# EAGLE design FlowControllerFinal (EAGLE 9.6.2)
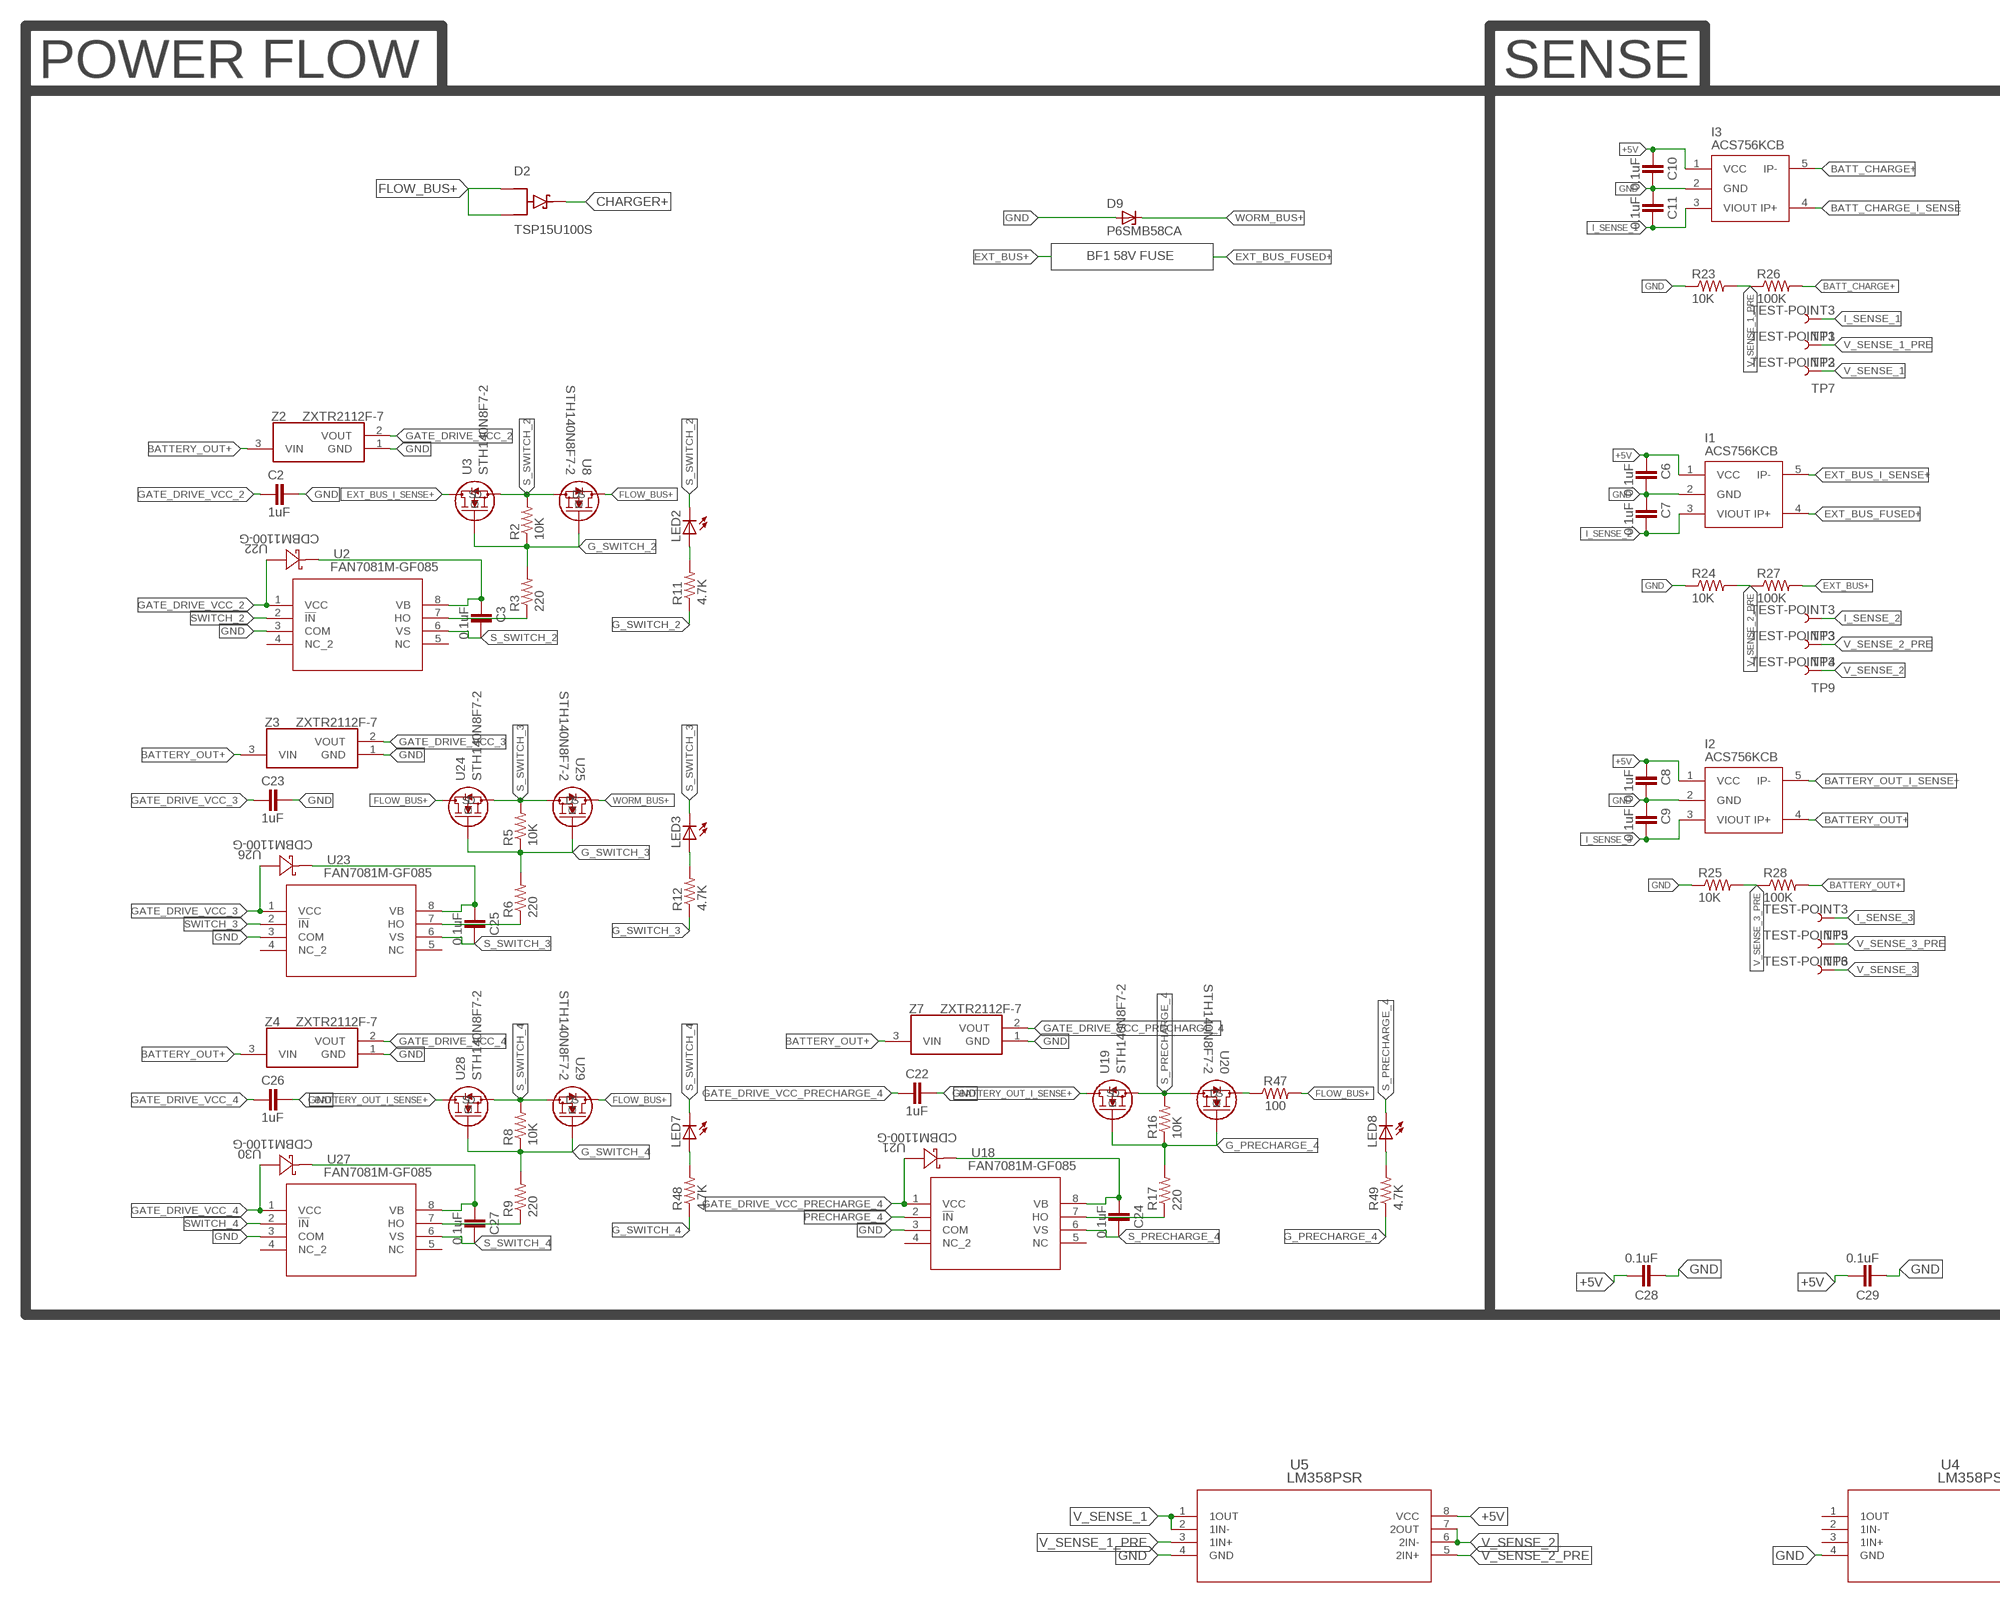
[diagram p0: schematic, sheet 1, part 1 of 2]
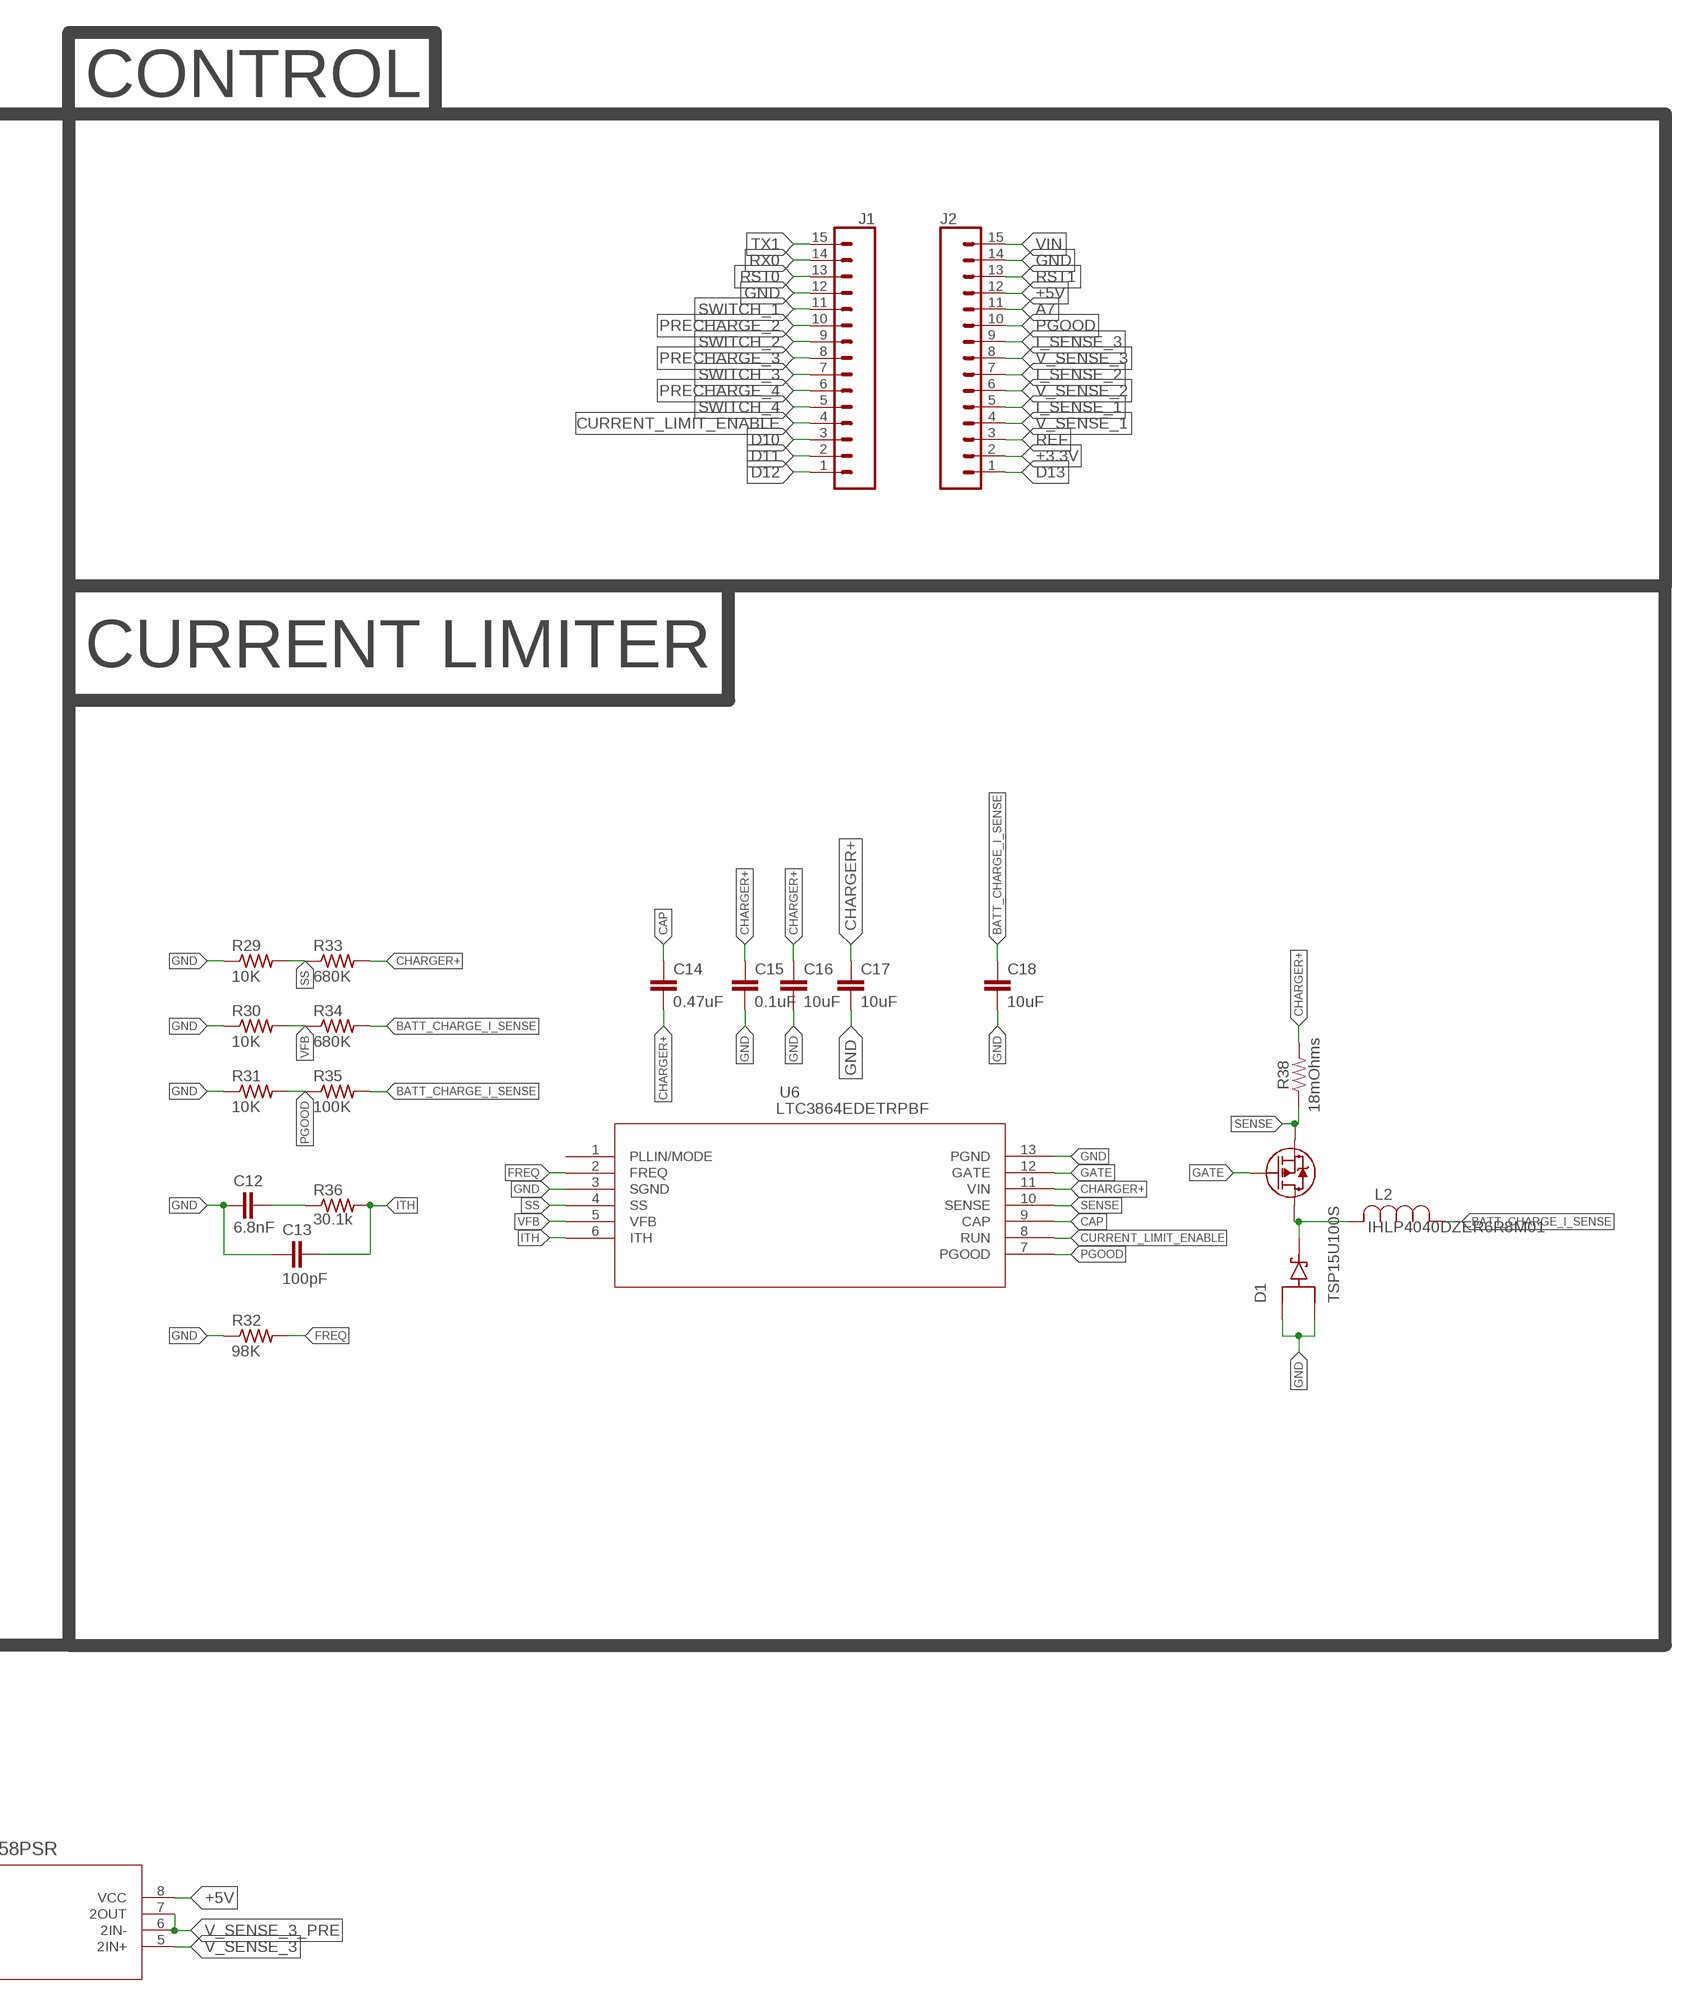
[diagram p1: schematic, sheet 1, part 2 of 2]

## Parts
C2  1uF  2.2UF-0805-25V-(+80/-20%)  [0805]
C3  0.1uF  2.2UF-0805-25V-(+80/-20%)  [0805]
C6  0.1uF  2.2UF-0805-25V-(+80/-20%)  [0805]
C7  0.1uF  2.2UF-0805-25V-(+80/-20%)  [0805]
C8  0.1uF  2.2UF-0805-25V-(+80/-20%)  [0805]
C9  0.1uF  2.2UF-0805-25V-(+80/-20%)  [0805]
C10  0.1uF  2.2UF-0805-25V-(+80/-20%)  [0805]
C11  0.1uF  2.2UF-0805-25V-(+80/-20%)  [0805]
C12  6.8nF  2.2UF-0805-25V-(+80/-20%)  [0805]
C13  100pF  2.2UF-0805-25V-(+80/-20%)  [0805]
C14  0.47uF  2.2UF-0805-25V-(+80/-20%)  [0805]
C15  0.1uF  2.2UF-0805-25V-(+80/-20%)  [0805]
C16  10uF  10UF-1210-50V-20%  [1210]
C17  10uF  10UF-1210-50V-20%  [1210]
C18  10uF  10UF-1210-50V-20%  [1210]
C22  1uF  2.2UF-0805-25V-(+80/-20%)  [0805]
C23  1uF  2.2UF-0805-25V-(+80/-20%)  [0805]
C24  0.1uF  2.2UF-0805-25V-(+80/-20%)  [0805]
C25  0.1uF  2.2UF-0805-25V-(+80/-20%)  [0805]
C26  1uF  2.2UF-0805-25V-(+80/-20%)  [0805]
C27  0.1uF  2.2UF-0805-25V-(+80/-20%)  [0805]
C28  0.1uF  2.2UF-0805-25V-(+80/-20%)  [0805]
C29  0.1uF  2.2UF-0805-25V-(+80/-20%)  [0805]
D1  TSP15U100S  [DIO_TSP15U100S]
D2  TSP15U100S  [DIO_TSP15U100S]
D9  P6SMB58CA  1SMB5913BT3G  [DO214AA]
I1  ACS756KCB  [ACS756KCB]
I2  ACS756KCB  [ACS756KCB]
I3  ACS756KCB  [ACS756KCB]
J1  CONN_15  [1X15]
J2  CONN_15  [1X15]
L2  IHLP4040DZER6R8M01  [IND_IHLP-4040DZ_VIS]
LED2  LEDCHIPLED_0805  [CHIPLED_0805]
LED3  LEDCHIPLED_0805  [CHIPLED_0805]
LED7  LEDCHIPLED_0805  [CHIPLED_0805]
LED8  LEDCHIPLED_0805  [CHIPLED_0805]
R2  10K  R-US_M0805  [M0805]
R3  220  R-US_M0805  [M0805]
R5  10K  R-US_M0805  [M0805]
R6  220  R-US_M0805  [M0805]
R8  10K  R-US_M0805  [M0805]
R9  220  R-US_M0805  [M0805]
R11  4.7K  R-US_M0805  [M0805]
R12  4.7K  R-US_M0805  [M0805]
R16  10K  R-US_M0805  [M0805]
R17  220  R-US_M0805  [M0805]
R23  10K  R-US_M0805  [M0805]
R24  10K  R-US_M0805  [M0805]
R25  10K  R-US_M0805  [M0805]
R26  100K  R-US_M0805  [M0805]
R27  100K  R-US_M0805  [M0805]
R28  100K  R-US_M0805  [M0805]
R29  10K  R-US_M0805  [M0805]
R30  10K  R-US_M0805  [M0805]
R31  10K  R-US_M0805  [M0805]
R32  98K  R-US_M0805  [M0805]
R33  680K  R-US_M0805  [M0805]
R34  680K  R-US_M0805  [M0805]
R35  100K  R-US_M0805  [M0805]
R36  30.1k  R-US_M0805  [M0805]
R37  RSJ250P10TL  [TRANS_R5009FNJ_ROM]
R38  18mOhms  0.05OHM-2512-3W-1%  [2512]
R47  100  0.05OHM-2512-3W-1%  [2512]
R48  4.7K  R-US_M0805  [M0805]
R49  4.7K  R-US_M0805  [M0805]
TP1  TEST-POINT3  [PAD.03X.03]
TP2  TEST-POINT3  [PAD.03X.03]
TP3  TEST-POINT3  [PAD.03X.03]
TP4  TEST-POINT3  [PAD.03X.03]
TP5  TEST-POINT3  [PAD.03X.03]
TP6  TEST-POINT3  [PAD.03X.03]
TP7  TEST-POINT3  [PAD.03X.03]
TP9  TEST-POINT3  [PAD.03X.03]
TP11  TEST-POINT3  [PAD.03X.03]
U2  FAN7081M-GF085  [SOIC8_3P9X4P9_ONS]
U3  STH140N8F7-2  [HPAK_0N8F7-2_STM]
U4  LM358PSR  [PS8]
U5  LM358PSR  [PS8]
U6  LTC3864EDETRPBF  [DFN-12_DE]
U8  STH140N8F7-2  [HPAK_0N8F7-2_STM]
U18  FAN7081M-GF085  [SOIC8_3P9X4P9_ONS]
U19  STH140N8F7-2  [HPAK_0N8F7-2_STM]
U20  STH140N8F7-2  [HPAK_0N8F7-2_STM]
U21  CDBM1100-G  [CDBM]
U22  CDBM1100-G  [CDBM]
U23  FAN7081M-GF085  [SOIC8_3P9X4P9_ONS]
U24  STH140N8F7-2  [HPAK_0N8F7-2_STM]
U25  STH140N8F7-2  [HPAK_0N8F7-2_STM]
U26  CDBM1100-G  [CDBM]
U27  FAN7081M-GF085  [SOIC8_3P9X4P9_ONS]
U28  STH140N8F7-2  [HPAK_0N8F7-2_STM]
U29  STH140N8F7-2  [HPAK_0N8F7-2_STM]
U30  CDBM1100-G  [CDBM]
Z2  ZXTR2112F-7  [SOT96P240X110-3N]
Z3  ZXTR2112F-7  [SOT96P240X110-3N]
Z4  ZXTR2112F-7  [SOT96P240X110-3N]
Z7  ZXTR2112F-7  [SOT96P240X110-3N]

## Nets
+3.3V: J2.2
+5V: C6.1 C8.1 C10.1 C28.2 C29.2 I1.1(VCC) I2.1(VCC) I3.1(VCC) J2.12 U4.8(VCC) U5.8(VCC)
A7: J2.11
BATT_CHARGE+: I3.5(IP-) R26.2
BATT_CHARGE_I_SENSE: C18.1 I3.4(IP+) L2.1 R34.2 R35.2
BATTERY_OUT+: I2.4(IP+) R28.2 Z2.3(VIN) Z3.3(VIN) Z4.3(VIN) Z7.3(VIN)
BATTERY_OUT_I_SENSE+: I2.5(IP-) U19.2(D) U28.2(D)
CAP: C14.1 U6.9(CAP)
CHARGER+: C14.2 C15.1 C16.1 C17.1 D2.3(K) R33.2 R38.P$2 U6.11(VIN)
CURRENT_LIMIT_ENABLE: J1.4 U6.8(RUN)
D10: J1.3
D11: J1.2
D12: J1.1
D13: J2.1
EXT_BUS+: R27.2
EXT_BUS_FUSED+: I1.4(IP+)
EXT_BUS_I_SENSE+: I1.5(IP-) U3.2(D)
FLOW_BUS+: D2.1(A1) D2.2(A2) R47.P$2 U8.2(D) U24.2(D) U29.2(D)
FREQ: R32.2 U6.2(FREQ)
G_PRECHARGE_4: R16.1 R17.2 R49.1 U19.1(G) U20.1(G)
G_SWITCH_2: R2.1 R3.2 R11.1 U3.1(G) U8.1(G)
G_SWITCH_3: R5.1 R6.2 R12.1 U24.1(G) U25.1(G)
G_SWITCH_4: R8.1 R9.2 R48.1 U28.1(G) U29.1(G)
GATE: R37.1 U6.12(GATE)
GATE_DRIVE_VCC_2: C2.1 U2.1(VCC) U22.2 Z2.2(VOUT)
GATE_DRIVE_VCC_3: C23.1 U23.1(VCC) U26.2 Z3.2(VOUT)
GATE_DRIVE_VCC_4: C26.1 U27.1(VCC) U30.2 Z4.2(VOUT)
GATE_DRIVE_VCC_PRECHARGE_4: C22.1 U18.1(VCC) U21.2 Z7.2(VOUT)
GND: C2.2 C6.2 C7.1 C8.2 C9.1 C10.2 C11.1 C12.1 C13.1 C15.2 C16.2 C17.2 C18.2 C22.2 C23.2 C26.2 C28.1 C29.1 D1.1(A1) D1.2(A2) D9.A I1.2(GND) I2.2(GND) I3.2(GND) J1.12 J2.14 R23.1 R24.1 R25.1 R29.1 R30.1 R31.1 R32.1 U2.3(COM) U4.4(GND) U5.4(GND) U6.3(SGND) U6.13(PGND) U18.3(COM) U23.3(COM) U27.3(COM) Z2.1(GND) Z3.1(GND) Z4.1(GND) Z7.1(GND)
I_SENSE_1: C11.2 I3.3(VIOUT) J2.5 TP1.P$1
I_SENSE_2: C7.2 I1.3(VIOUT) J2.7 TP3.P$1
I_SENSE_3: C9.2 I2.3(VIOUT) J2.9 TP5.P$1
ITH: C13.2 R36.2 U6.6(ITH)
N$2: LED8.A R49.2
N$3: LED2.A R11.2
N$7: R3.1 U2.7(HO)
N$9: C3.1 U2.8(VB) U22.1
N$13: R47.P$1 U20.2(D)
N$16: R6.1 U23.7(HO)
N$18: C25.1 U23.8(VB) U26.1
N$19: R17.1 U18.7(HO)
N$20: R9.1 U27.7(HO)
N$21: C24.1 U18.8(VB) U21.1
N$22: C27.1 U27.8(VB) U30.1
N$23: C12.2 R36.1
N$24: D1.3(K) L2.2 R37.2
N$26: LED3.A R12.2
N$27: LED7.A R48.2
PGOOD: J2.10 R31.2 R35.1 U6.7(PGOOD)
PRECHARGE_2: J1.10
PRECHARGE_3: J1.8
PRECHARGE_4: J1.6 U18.2(!IN)
REF: J2.3
RST0: J1.13
RST1: J2.13
RX0: J1.14
S_PRECHARGE_4: C24.2 LED8.C R16.2 U18.6(VS) U19.3(S) U20.3(S)
S_SWITCH_2: C3.2 LED2.C R2.2 U2.6(VS) U3.3(S) U8.3(S)
S_SWITCH_3: C25.2 LED3.C R5.2 U23.6(VS) U24.3(S) U25.3(S)
S_SWITCH_4: C27.2 LED7.C R8.2 U27.6(VS) U28.3(S) U29.3(S)
SENSE: R37.3 R38.P$1 U6.10(SENSE)
SS: R29.2 R33.1 U6.4(SS)
SWITCH_1: J1.11
SWITCH_2: J1.9 U2.2(!IN)
SWITCH_3: J1.7 U23.2(!IN)
SWITCH_4: J1.5 U27.2(!IN)
TX1: J1.15
V_SENSE_1: J2.4 TP7.P$1 U5.1(1OUT) U5.2(1IN-)
V_SENSE_1_PRE: R23.2 R26.1 TP2.P$1 U5.3(1IN+)
V_SENSE_2: J2.6 TP9.P$1 U5.6(2IN-) U5.7(2OUT)
V_SENSE_2_PRE: R24.2 R27.1 TP4.P$1 U5.5(2IN+)
V_SENSE_3: J2.8 TP11.P$1 U4.5(2IN+)
V_SENSE_3_PRE: R25.2 R28.1 TP6.P$1 U4.6(2IN-) U4.7(2OUT)
VFB: R30.2 R34.1 U6.5(VFB)
VIN: J2.15
WORM_BUS+: D9.C U25.2(D)
Unconnected: U2.4(NC_2) U2.5(NC) U4.1(1OUT) U4.2(1IN-) U4.3(1IN+) U6.1(PLLIN/MODE) U18.4(NC_2) U18.5(NC) U23.4(NC_2) U23.5(NC) U27.4(NC_2) U27.5(NC)

## Notes on the sheet
- POWER FLOW | SENSE | CONTROL
- BF1 58V FUSE
- CURRENT LIMITER

## Library data of the parts
C2 C3 C6-C15 C22-C29 = SparkFun-Capacitors:2.2UF: 2.2µF ceramic capacitors A capacitor is a passive two-terminal electrical component used to store electrical energy temporarily in an electric field.; PROD_ID: CAP-11624; VALUE: 2.2uF
C16-C18 = SparkFun-Capacitors:10UF: 10.0µF ceramic capacitors A capacitor is a passive two-terminal electrical component used to store electrical energy temporarily in an electric field.; PROD_ID: CAP-09824
D1 D2 = TSP15U100S:TSP15U100S; DESCRIPTION: 15A, 100V, Trench Schottky; DIGI-KEY_PART_NUMBER: 1801-TSP15U100STR-ND; MF: Taiwan Semiconductor; MP: TSP15U100S; PACKAGE: SMPC Taiwan Semiconductor; PURCHASE-URL: https://pricing.snapeda.com/search/part/TSP15U100S/?ref=eda
D9 = 1smb59xx_10:1SMB59*BT3G: 1SMB59xxBT3G Series 3 Watt Plastic Surface Mount Zener Voltage Regulators Source: http://www.onsemi.com/pub_link/Collateral/1SMB5913BT3-D.PDF; MF: ON Semiconductor; MPN: 1SMB5913BT3G; OC_FARNELL: 1431155; OC_NEWARK: 88H5165
I1-I3 = FlowControllerLib:ACS756KCB
J1 = SparkFun-Connectors:CONN_15: Multi connection point. Often used as Generic Header-pin footprint for 0.1 inch spaced/style header connections On any of the 0.1 inch spaced packages, you can populate with these: Break Away Headers - Straight <https://www.sparkfun.com/products/116> (PRT-00116) Break Away Male Headers - Right Angle <https://www.sparkfun.com/products/553> (PRT-00553) Female Headers <https://www.sparkfun.com/products/115> (PRT-00115) Break Away Headers - Machine Pin <https://www.sparkfun.com/products/117> (PRT-00117) Break Away Female Headers - Swiss Machine Pin <https://www.sparkfun.com/products/743> (PRT-00743) For SCREWTERMINALS and SPRING TERMINALS visit here: Screw Terimnals on SparkFun.com <https://www.sparkfun.com/search/results?term=Screw+Terminals> (5mm/3.5mm/2.54mm spacing) This device is also useful as a general connection point to wire up your design to another part of your project. Our various solder wires solder well into these plated through hole pads. Hook-Up Wire - Assortment (Stranded, 22 AWG) <https://www.sparkfun.com/products/11375> (PRT-11375) Hook-Up Wire - Assortment (Solid Core, 22 AWG) <https://www.sparkfun.com/products/11367> (PRT-11367) View the entire wire category on our website here <https://www.sparkfun.com/categories/141> Special notes: Molex polarized connector foot print use with SKU : PRT-08231 with associated crimp pins and housings. 1MM SMD Version SKU: PRT-10208 NOTES ON THE VARIANTS LOCK and LOCK_LONGPADS... This footprint was designed to help hold the alignment of a through-hole component (i.e. 6-pin header) while soldering it into place. You may notice that each hole has been shifted either up or down by 0.005 of an inch from it's more standard position (which is a perfectly straight line). This slight alteration caused the pins (the squares in the middle) to touch the edges of the holes. Because they are alternating, it causes a "brace" to hold the component in place. 0.005 has proven to be the perfect amount of "off-center" position when using our standard breakaway headers. Although looks a little odd when you look at the bare footprint, once you have a header in there, the alteration is very hard to notice. Also,if you push a header all the way into place, it is covered up entirely on the bottom side.
J2 = SparkFun-Connectors:CONN_15: Multi connection point. Often used as Generic Header-pin footprint for 0.1 inch spaced/style header connections On any of the 0.1 inch spaced packages, you can populate with these: Break Away Headers - Straight <https://www.sparkfun.com/products/116> (PRT-00116) Break Away Male Headers - Right Angle <https://www.sparkfun.com/products/553> (PRT-00553) Female Headers <https://www.sparkfun.com/products/115> (PRT-00115) Break Away Headers - Machine Pin <https://www.sparkfun.com/products/117> (PRT-00117) Break Away Female Headers - Swiss Machine Pin <https://www.sparkfun.com/products/743> (PRT-00743) For SCREWTERMINALS and SPRING TERMINALS visit here: Screw Terimnals on SparkFun.com <https://www.sparkfun.com/search/results?term=Screw+Terminals> (5mm/3.5mm/2.54mm spacing) This device is also useful as a general connection point to wire up your design to another part of your project. Our various solder wires solder well into these plated through hole pads. Hook-Up Wire - Assortment (Stranded, 22 AWG) <https://www.sparkfun.com/products/11375> (PRT-11375) Hook-Up Wire - Assortment (Solid Core, 22 AWG) <https://www.sparkfun.com/products/11367> (PRT-11367) View the entire wire category on our website here <https://www.sparkfun.com/categories/141> Special notes: Molex polarized connector foot print use with SKU : PRT-08231 with associated crimp pins and housings. 1MM SMD Version SKU: PRT-10208 NOTES ON THE VARIANTS LOCK and LOCK_LONGPADS... This footprint was designed to help hold the alignment of a through-hole component (i.e. 6-pin header) while soldering it into place. You may notice that each hole has been shifted either up or down by 0.005 of an inch from it's more standard position (which is a perfectly straight line). This slight alteration caused the pins (the squares in the middle) to touch the edges of the holes. Because they are alternating, it causes a "brace" to hold the component in place. 0.005 has proven to be the perfect amount of "off-center" position when using our standard breakaway headers. Although looks a little odd when you look at the bare footprint, once you have a header in there, the alteration is very hard to notice. Also,if you push a header all the way into place, it is covered up entirely on the bottom side.; SPICEPREFIX: X
L2 = CurrentLimiter:IHLP4040DZER6R8M01; COPYRIGHT: Copyright (C) 2022 Ultra Librarian. All rights reserved.; DIGI-KEY_PART_NUMBER_1: 541-1303-1-ND; DIGI-KEY_PART_NUMBER_2: 541-1303-2-ND; DIGI-KEY_PART_NUMBER_3: 541-1303-6-ND; MANUFACTURER_PART_NUMBER: IHLP4040DZER6R8M01; MFR_NAME: Vishay
LED2 LED3 LED7 LED8 = adafruit:LED: LED OSRAM: - CHIPLED LG R971, LG N971, LY N971, LG Q971, LY Q971, LO R971, LY R971 LH N974, LH R974 LS Q976, LO Q976, LY Q976 LO Q996 - Hyper CHIPLED LW Q18S LB Q993, LB Q99A, LB R99A - SideLED LS A670, LO A670, LY A670, LG A670, LP A670 LB A673, LV A673, LT A673, LW A673 LH A674 LY A675 LS A676, LA A676, LO A676, LY A676, LW A676 LS A679, LY A679, LG A679 - Hyper Micro SIDELED® LS Y876, LA Y876, LO Y876, LY Y876 LT Y87S - SmartLED LW L88C, LW L88S LB L89C, LB L89S, LG L890 LS L89K, LO L89K, LY L89K LS L896, LA L896, LO L896, LY L896 - TOPLED LS T670, LO T670, LY T670, LG T670, LP T670 LSG T670, LSP T670, LSY T670, LOP T670, LYG T670 LG T671, LOG T671, LSG T671 LB T673, LV T673, LT T673, LW T673 LH T674 LS T676, LA T676, LO T676, LY T676, LB T676, LH T676, LSB T676, LW T676 LB T67C, LV T67C, LT T67C, LS T67K, LO T67K, LY T67K, LW E67C LS E67B, LA E67B, LO E67B, LY E67B, LB E67C, LV E67C, LT E67C LW T67C LS T679, LY T679, LG T679 LS T770, LO T770, LY T770, LG T770, LP T770 LB T773, LV T773, LT T773, LW T773 LH T774 LS E675, LA E675, LY E675, LS T675 LS T776, LA T776, LO T776, LY T776, LB T776 LHGB T686 LT T68C, LB T68C - Hyper Mini TOPLED® LB M676 - Mini TOPLED Santana® LG M470 LS M47K, LO M47K, LY M47K Source: http://www.osram.convergy.de/
R2 R3 R5 R6 R8 R9 R11 R12 R16 R17 R23-R36 R48 R49 = adafruit:R-US_: RESISTOR, American symbol
R37 = CurrentLimiter:RSJ250P10TL; COPYRIGHT: Copyright (C) 2022 Ultra Librarian. All rights reserved.; DIGI-KEY_PART_NUMBER_1: RSJ250P10TLCT-ND; DIGI-KEY_PART_NUMBER_2: RSJ250P10TLDKR-ND; DIGI-KEY_PART_NUMBER_3: RSJ250P10TLTR-ND; MANUFACTURER_PART_NUMBER: RSJ250P10TL; MFR_NAME: ROHM Semiconductor
R38 R47 = SparkFun-Resistors:0.05OHM: 0.05Ω resistor A resistor is a passive two-terminal electrical component that implements electrical resistance as a circuit element. Resistors act to reduce current flow, and, at the same time, act to lower voltage levels within circuits. - Wikipedia; PROD_ID: RES-13771; VALUE: 0.05
TP1-TP7 TP9 TP11 = SparkFun-Connectors:TEST-POINT: SparkFun Test Points Bare copper test points for troubleshooting or In-Circuit-Testing. These are used by our Production team for verifying production board runs using pogo-pins on test beds. SparkFun Products: SparkFun LSM9DS1 Breakout <https://www.sparkfun.com/products/13284> SparkFun PSOC <https://www.sparkfun.com/products/13714> SparkFun Load Cell Amplifier <https://www.sparkfun.com/products/13879>
U2 U18 U23 U27 = FlowControllerLib:FAN7081M-GF085; COPYRIGHT: Copyright (C) 2022 Ultra Librarian. All rights reserved.; DIGI-KEY_PART_NUMBER_1: FAN7081M-GF085-ND; MANUFACTURER_PART_NUMBER: FAN7081M-GF085; MFR_NAME: onsemi
U3 U8 U19 U20 U24 U25 U28 U29 = FlowControllerLib:STH140N8F7-2; COPYRIGHT: Copyright (C) 2022 Ultra Librarian. All rights reserved.; DIGI-KEY_PART_NUMBER_1: 497-14534-2-ND; DIGI-KEY_PART_NUMBER_2: 497-14534-1-ND; DIGI-KEY_PART_NUMBER_3: 497-14534-6-ND; MANUFACTURER_PART_NUMBER: STH140N8F7-2; MFR_NAME: STMicroelectronics
U4 U5 = FlowControllerLib:LM358PSR; COPYRIGHT: Copyright (C) 2022 Ultra Librarian. All rights reserved.; DIGI-KEY_PART_NUMBER_1: 296-1396-1-ND; DIGI-KEY_PART_NUMBER_2: 296-1396-2-ND; DIGI-KEY_PART_NUMBER_3: 296-1396-6-ND; DIGI-KEY_PART_NUMBER_4: 2156-LM358PSR-ND; MANUFACTURER_PART_NUMBER: LM358PSR; MFR_NAME: Texas Instruments
U6 = LTC3864EDETRPBF:LTC3864EDETRPBF; DESCRIPTION: Buck Regulator Positive Output Step-Down - DC-DC Controller IC 12-DFN (4x3); DIGI-KEY_PART_NUMBER: 161-LTC3864EDE#TRPBFTR-ND; MF: Analog Devices; MP: LTC3864EDE#TRPBF; PACKAGE: DFN -12 Analog Devices; PURCHASE-URL: https://pricing.snapeda.com/search/part/LTC3864EDE#TRPBF/?ref=eda
U21 U22 U26 U30 = FlowControllerLib:CDBM1100-G; COPYRIGHT: Copyright (C) 2022 Ultra Librarian. All rights reserved.; DIGI-KEY_PART_NUMBER_1: 641-1331-1-ND; DIGI-KEY_PART_NUMBER_2: 641-1331-2-ND; DIGI-KEY_PART_NUMBER_3: 641-1331-2-NDL; DIGI-KEY_PART_NUMBER_4: 641-1331-6-ND; MANUFACTURER_PART_NUMBER: CDBM1100-G; MFR_NAME: Comchip
Z2-Z4 Z7 = SamacSys_Parts:ZXTR2112F-7: Linear Voltage Regulators Transistor Array Zener Linear Reg Source: Datasheet <https://www.diodes.com/assets/Datasheets/ZXTR2112F.pdf>; DESCRIPTION: Linear Voltage Regulators Transistor Array Zener Linear Reg; HEIGHT: 1.1mm; MANUFACTURER_NAME: Diodes Inc.; MANUFACTURER_PART_NUMBER: ZXTR2112F-7; MOUSER_PART_NUMBER: 621-ZXTR2112F-7; MOUSER_PRICE-STOCK: https://www.mouser.co.uk/ProductDetail/Diodes-Incorporated/ZXTR2112F-7?qs=AsTZqt%2FmeqkIS3oif4D14w%3D%3D

## Board
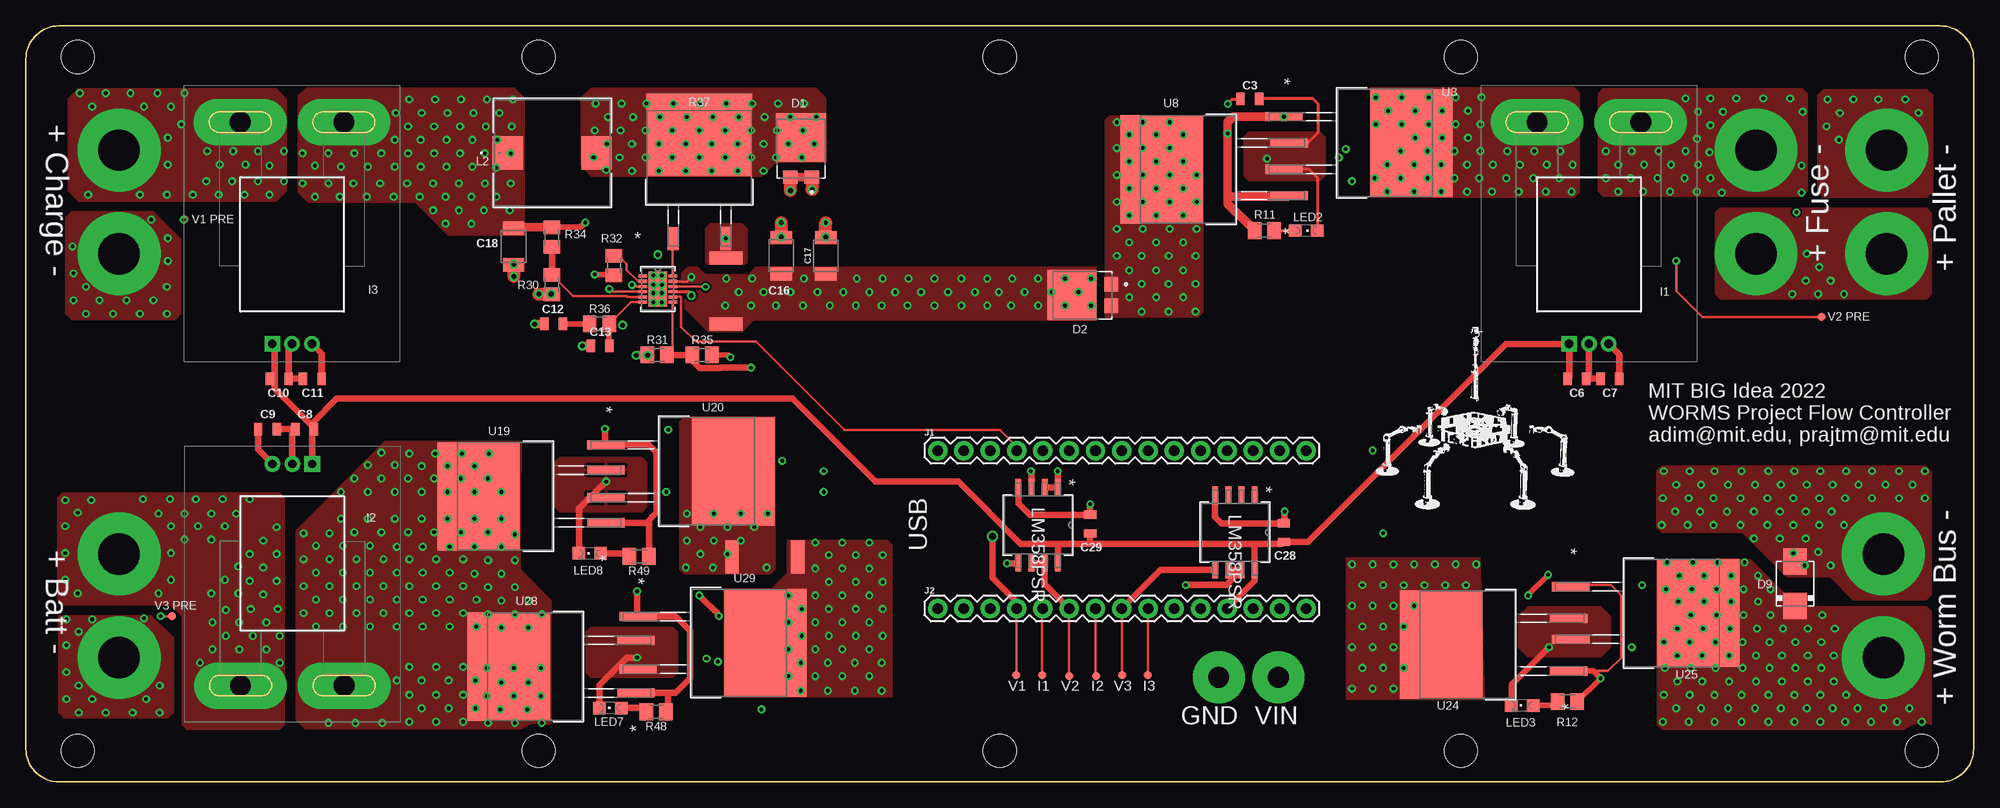
[diagram p2: board, top side]
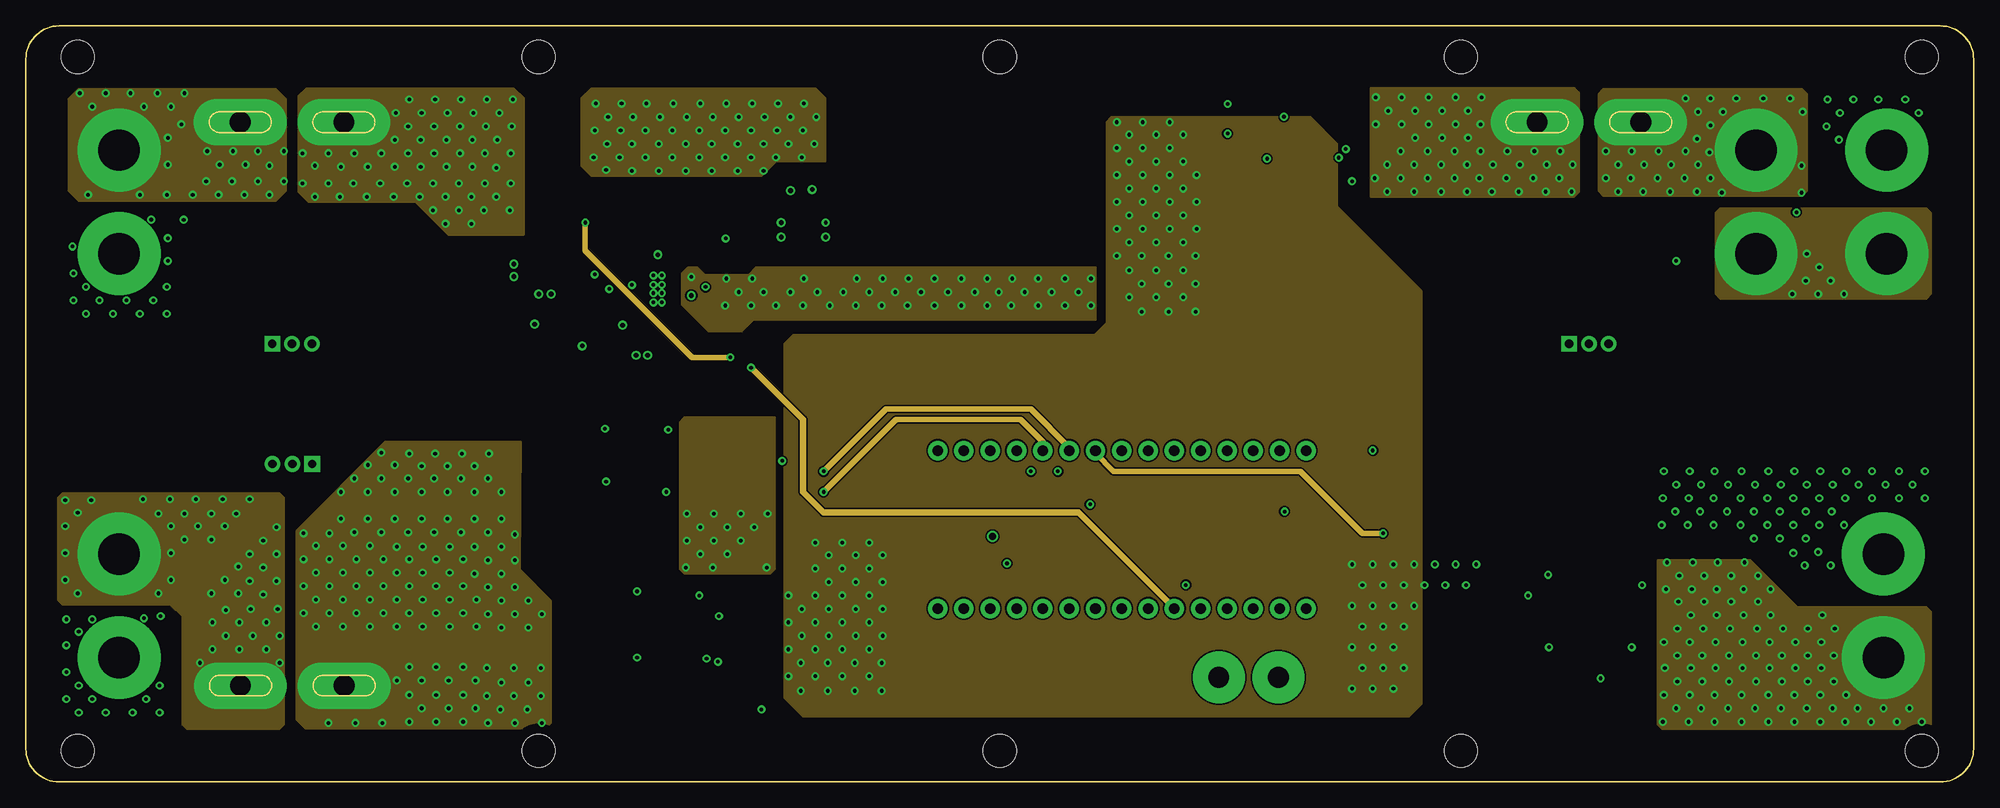
[diagram p3: board, inner layer Route2]
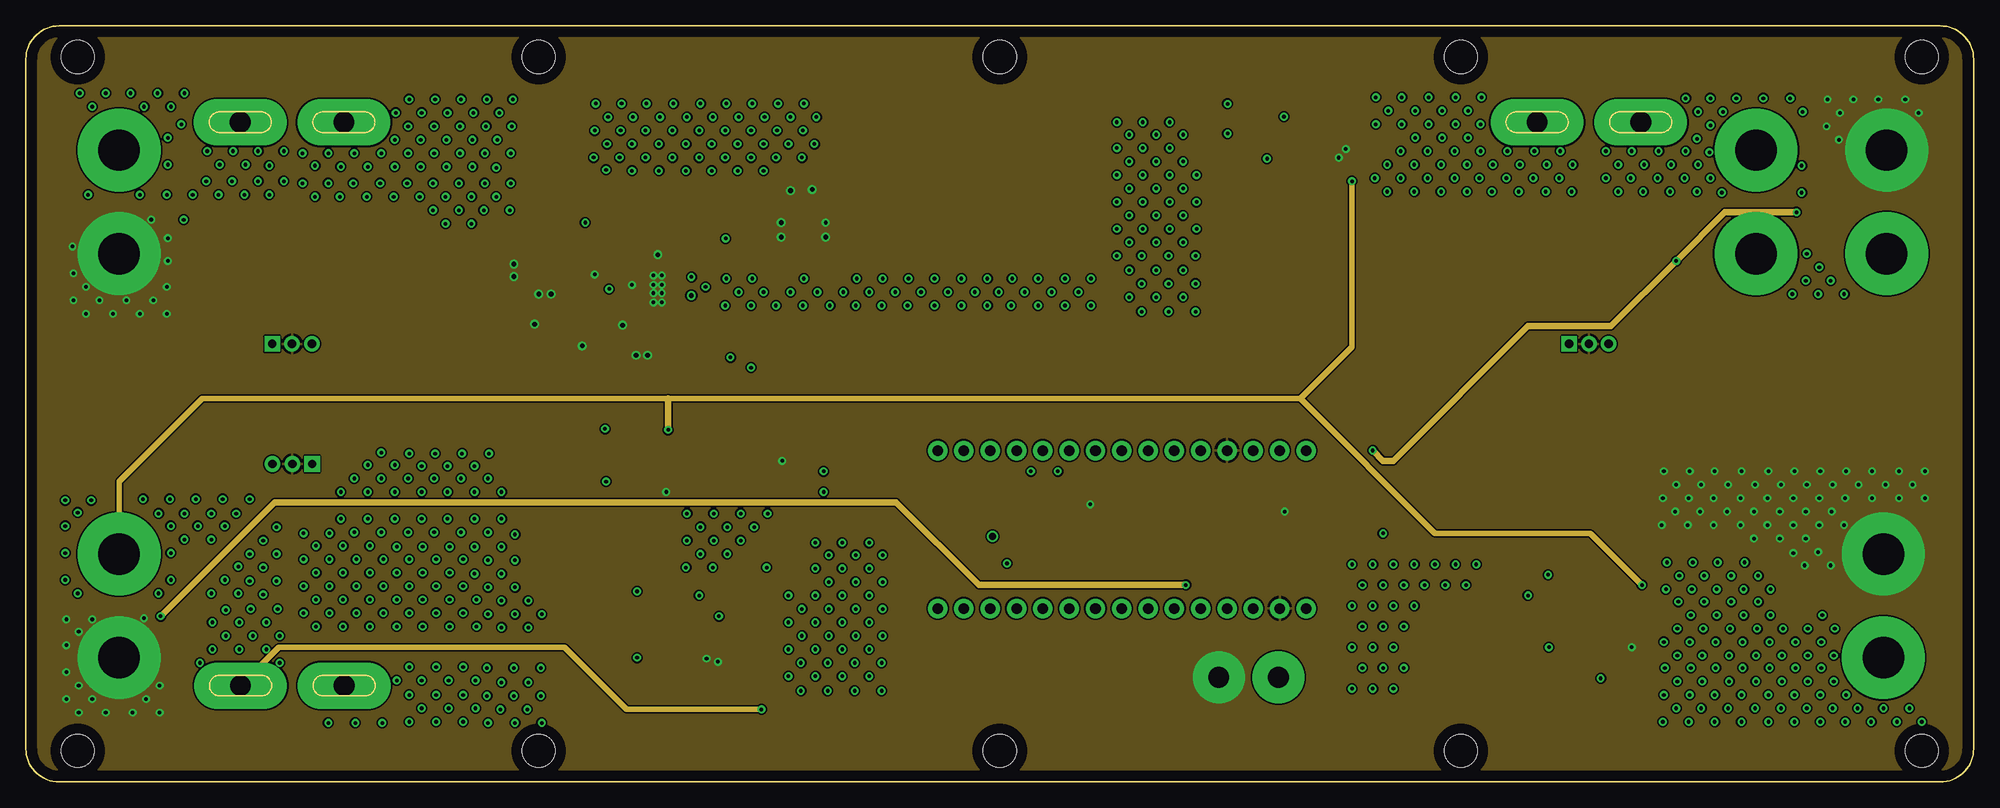
[diagram p4: board, inner layer Route15]
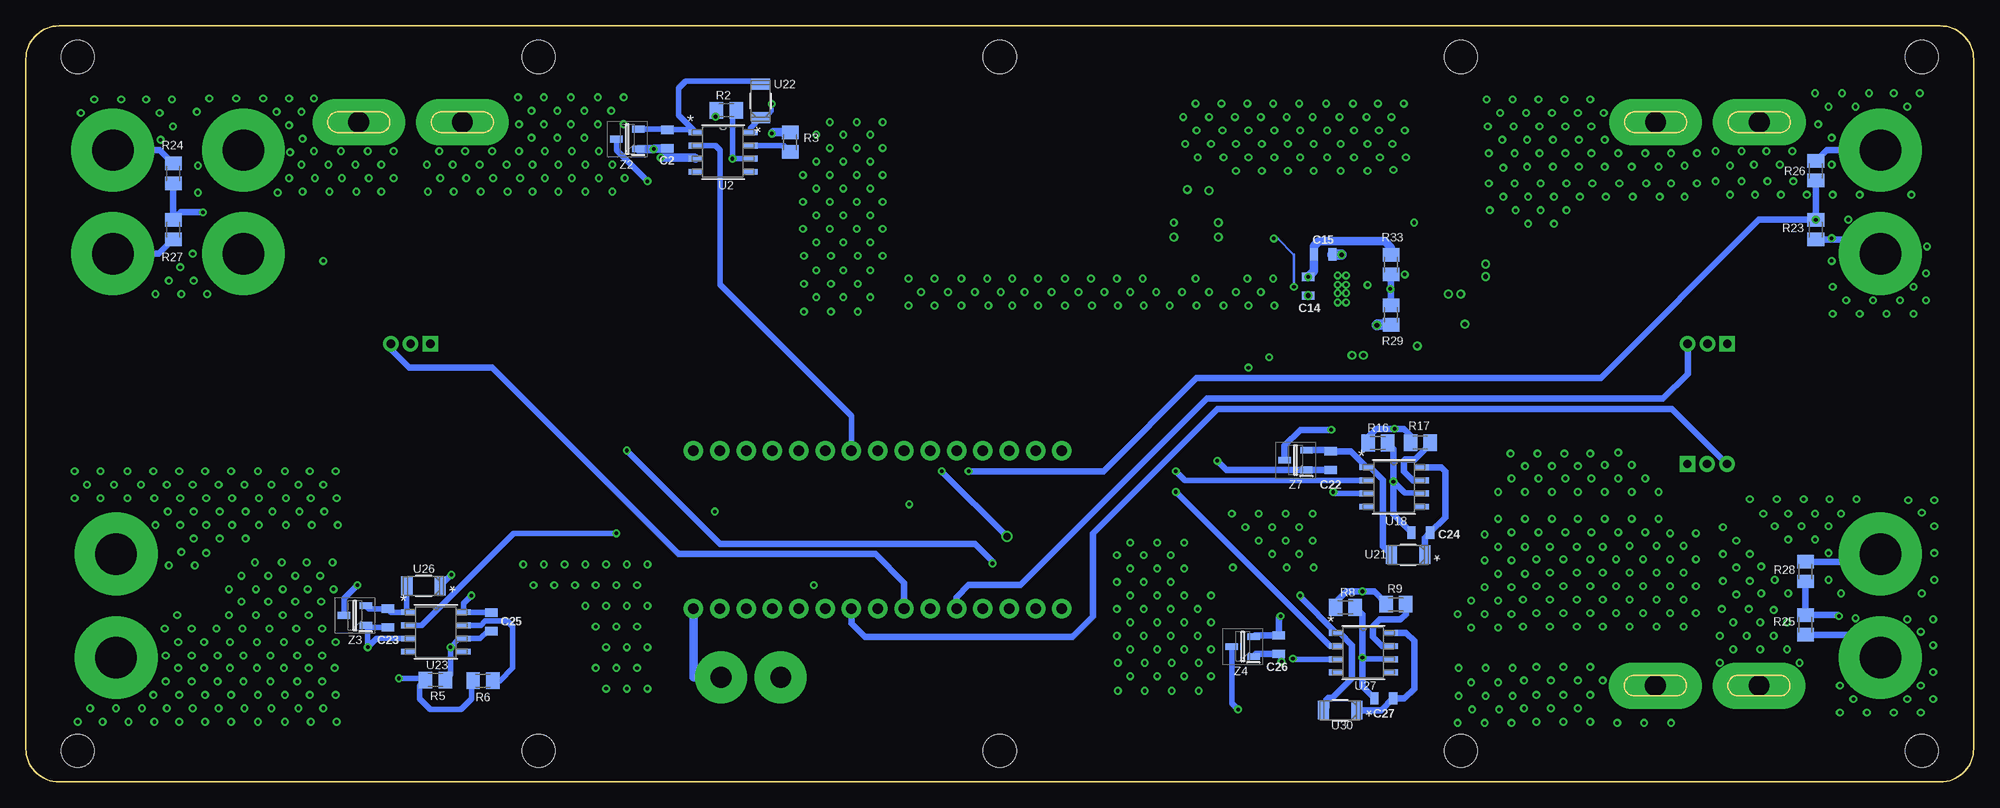
[diagram p5: board, bottom side, seen from below]

Size 188 x 73 mm. Coordinates in mm from the lower left corner, seen from the top.
Outline: 188,3.2 188,69.8 arc90 184.8,73 3.2,73 arc90 0,69.8 0,3.2 arc90 3.2,0 184.8,0 arc90 188,3.2
Copper layers (1+2*15+16): Top 0.035mm / dielectric 1.5mm / Route2 0.035mm / dielectric 0.15mm / Route15 0.035mm / dielectric 0.2mm / Bottom 0.035mm
Design rules "default *": minimum track width 6mil, minimum drill 0.35mm, track to track 6mil, track to pad 6mil, pad to pad 6mil, via to via 6mil, smd to smd 6mil, copper to edge 40mil, drill to drill 6mil, minimum pad ring 10mil, minimum via ring 8mil, stop-mask expansion 4mil, vias tented up to drill 0.45mm, thermal gap 10mil
Holes 3.2 mm at 5,3 49.5,3 94,3 138.5,3 183,3 5,70 49.5,70 94,70 138.5,70 183,70

### Footprints (pad centres in the part's own frame; a part is rotated, then mirrored left to right if it is on the bottom)
0805 = smd 0.8 x 1.2: 1 -0.9,0; 2 0.9,0
1210 = smd 1.27 x 2.06: 1 -1.755,0; 2 1.755,0
DIO_TSP15U100S = smd 1.27 x 1.4: 1 -2.765,-1.04; 2 -2.765,1.04 | smd 4.72 x 4.8: 3 1.04,0
DO214AA = smd 2.5 x 2.3: A 2.15,0; C -2.15,0
ACS756KCB = drill 0.8 pad 1.5 square: 1 -1.91,-10.7 | drill 0.8 pad 1.5: 2 0,-10.7; 3 1.91,-10.7 | drill 2 pad 4.5 long: 4 5,10.7; 5 -5,10.7
1X15 = drill 1.016 pad 1.88: 1 0,0; 2 2.54,0; 3 5.08,0; 4 7.62,0; 5 10.16,0; 6 12.7,0; 7 15.24,0; 8 17.78,0; 9 20.32,0; 10 22.86,0; 11 25.4,0; 12 27.94,0; 13 30.48,0; 14 33.02,0; 15 35.56,0
IND_IHLP-4040DZ_VIS = smd 2.921 x 3.251: 1 -4.28,0; 2 4.28,0
CHIPLED_0805 = smd 1.2 x 1.2: A 0,-1.05; C 0,1.05
M0805 = smd 1.3 x 1.6: 1 -0.95,0; 2 0.95,0
TRANS_R5009FNJ_ROM = smd 1.041 x 2.199: 1 -2.54,-7.861; 3 2.54,-7.861 | smd 10.16 x 7.95: 2 0,2.146
2512 = smd 1.27 x 3.175: P$1 -3.175,0; P$2 3.175,0
PAD.03X.03 = smd 0.762 x 0.762: P$1 0,0
SOIC8_3P9X4P9_ONS = smd 1.411 x 0.558: 1 -2.642,1.905; 2 -2.642,0.635; 3 -2.642,-0.635; 4 -2.642,-1.905; 5 2.642,-1.905; 6 2.642,-0.635; 7 2.642,0.635; 8 2.642,1.905
HPAK_0N8F7-2_STM = smd 0.888 x 3.596: 1 -2.54,-9.779; 3 2.54,-9.779 | smd 10.439 x 7.95: 2 0,2.527
PS8 = smd 1.64 x 0.558: 1 -3.632,1.905; 2 -3.632,0.635; 3 -3.632,-0.635; 4 -3.632,-1.905; 5 3.632,-1.905; 6 3.632,-0.635; 7 3.632,0.635; 8 3.632,1.905
DFN-12_DE = smd 0.813 x 0.305: 1 -1.448,1.25; 2 -1.448,0.75; 3 -1.448,0.25; 4 -1.448,-0.25; 5 -1.448,-0.75; 6 -1.448,-1.25; 7 1.448,-1.25; 8 1.448,-0.75; 9 1.448,-0.25; 10 1.448,0.25; 11 1.448,0.75; 12 1.448,1.25 | smd 1.803 x 3.404: 13 0,0
CDBM = smd 1.092 x 1.803: 1 -1.613,0; 2 1.613,0
SOT96P240X110-3N = smd 1.2 x 0.65: 1 -1.05,0.96; 2 -1.05,-0.96; 3 1.05,0

### Placement (x,y rotation side)
C2  126.07,62.06 270 bottom
C3  118.13,65.93 0 top
C6  149.7,38.93 0 top
C7  152.89,38.93 0 top
C8  26.92,34.07 180 top
C9  23.33,34.07 180 top
C10  24.46,38.93 0 top
C11  27.65,38.93 0 top
C12  50.94,44.23 0 top
C13  55.43,42.13 0 top
C14  64.23,47.86 90 bottom
C15  62.78,50.93 0 bottom
C16  72.92,50.81 90 top
C17  77.2,50.8 90 top
C18  47.08,51.69 270 top
C22  62.07,31.02 270 bottom
C23  153.07,15.83 270 bottom
C24  53.36,24.07 180 bottom
C25  143.07,15.45 270 bottom
C26  67.07,13.26 270 bottom
C27  56.93,8.07 180 bottom
C28  121.43,24.08 270 top
C29  102.73,24.89 270 top
D1  74.82,61.15 90 top
D2  102,47 180 top
D9  170.77,19.14 90 top
I1  150.87,53 0 top
I2  25.72,20 180 top
I3  25.69,53 0 top
J1  88,32 0 top
J2  88,16.75 0 top
L2  50.81,60.75 0 top
LED2  123.58,53.23 270 top
LED3  144.42,7.39 90 top
LED7  56.42,7.15 90 top
LED8  54.42,22.07 90 top
R2  120.4,64.85 0 bottom
R3  114.23,61.77 90 bottom
R5  148.48,9.85 0 bottom
R6  143.88,9.77 180 bottom
R8  60.64,16.85 0 bottom
R9  55.76,17.15 180 bottom
R11  119.56,53.23 0 top
R12  148.79,7.77 180 top
R16  57.51,32.73 0 bottom
R17  53.41,32.77 180 bottom
R23  15.23,53.33 90 bottom
R24  173.77,58.75 270 bottom
R25  16.23,15.17 90 bottom
R26  15.23,59.01 90 bottom
R27  173.77,53.34 270 bottom
R28  16.23,20.31 90 bottom
R29  56.23,45.09 90 bottom
R30  50.77,48.01 90 top
R31  60.93,41.23 0 top
R32  56.77,49.85 90 top
R33  56.23,49.96 90 bottom
R34  50.77,52.61 90 top
R35  65.26,41.23 0 top
R36  55.36,44.23 0 top
R37  65.01,60.33 0 top
R38  67.6,47.4 270 top
R47  71.33,21.74 0 top
R48  60.84,6.77 180 top
R49  59.19,21.77 180 top
TP1  98.1,10.3 0 top
TP2  15.3,54.3 0 top
TP3  103.3,10.2 0 top
TP4  173.3,44.9 0 top
TP5  108.3,10.3 0 top
TP6  14.1,16 0 top
TP7  95.6,10.3 0 top
TP9  100.7,10.2 0 top
TP11  105.8,10.3 0 top
U2  120.71,60.81 0 bottom
U3  131.21,61.69 270 top
U4  116.7,24.1 270 top
U5  97.7,24.8 270 top
U6  60.99,47.58 0 top
U8  112.16,59.15 90 top
U18  55.94,28.48 0 bottom
U19  46.23,27.57 90 top
U20  65.77,29.99 270 top
U21  54.58,21.93 180 bottom
U22  117.07,65.75 90 bottom
U23  148.42,14.48 0 bottom
U24  139.13,13.25 90 top
U25  158.87,16.31 270 top
U26  149.62,18.93 180 bottom
U27  58.9,12.48 0 bottom
U28  49.13,11.13 90 top
U29  68.87,13.43 270 top
U30  61.14,6.93 180 bottom
Z2  129.95,62.07 180 bottom
Z3  156.25,16.07 180 bottom
Z4  70.55,13.07 180 bottom
Z7  65.45,31.07 180 bottom

### Tracks (layer width: path | path; a pad name or v marks a point on that pad's centre or on a via)
+5V
  Top 0.61: I3.1 24,42.08 24,39 | 24,39 24,38 27.63,34.37 | 27.63,34.37 27.63,34 | 27.63,34 I2.1 | 27.63,34.37 27.63,34.63 30,37 74,37 82,29 90,29 96,23 99.7,23 | 99.7,23 102.73,23 | C10.1 23.63,39 24,39 | C8.1 27.75,34 27.63,34 | C6.1 148.96,39.09 I1.1 142.85,42.3 123.73,23.18 C28.2 121.25,23 118.6,23 | C29.2 102.73,23 | U5.8 99.61,22.91 99.7,23 | U4.8 | U4.8 118.6,23 | 102.73,23 118.6,23 | J2.12 118.6,19.41 U4.8
BATT_CHARGE+  (via drill 0.35, 4 pad 8)
  Bottom 0.61: v9,61 14.19,61 R26.2
  other vias: 15,63.5 13.7,62.2 17.5,60.9 20,60.9 22.4,60.9 24.9,60.9 13.7,59.6 18.7,59.6 21.2,59.6 6,56.7 11,56.7 13.6,56.7 17.4,58 16.1,56.7 19.9,58 18.6,56.7 21.1,56.7 23.5,56.7 22.4,58 24.9,58 23.5,59.5 5.2,66.5 6.4,65.2 10.1,66.5 12.7,66.5 15.3,66.5 7.7,66.5 11.4,65.2 14,65.2
  pour Top (no thermals): 4.08,65.92 4.08,57.08 5.08,56.08 24.12,56.08 25.12,57.08 25.12,65.92 24.12,66.92 5.08,66.92
  pour Route2 (no thermals): 4.08,65.92 4.08,57.08 5.08,56.08 24.12,56.08 25.12,57.08 25.12,65.92 24.12,66.92 5.08,66.92
BATT_CHARGE_I_SENSE  (via drill 0.35)
  Top 0.508: R35.2 67.77,41.23 v68,41 | R34.2 53.56,53.56 v54,54
  Top 0.813: 46.59,53.56 R34.2
  Route2 0.508: v54,54 54,51.3 64.3,41 v68,41
  other vias: 26.7,60.7 36.9,63.3 31.7,60.7 34.3,60.7 35.6,62 36.9,60.7 29.2,60.7 39.4,63.3 38.1,62 39.4,60.7 42,65.9 40.7,64.6 43.2,64.6 41.9,60.7 41.9,63.3 40.6,62 44.3,60.7 43.1,62 37,65.9 35.7,64.6 39.5,65.9 38.2,64.6 45.5,62 46.8,60.7 44.4,63.3 47,65.9 45.7,64.6 46.9,63.3 44.5,65.9 27.9,59.5 30.4,59.4 33,59.4 35.6,59.4 38.1,59.4 40.6,59.4 43.1,59.4 26.7,57.8 27.9,56.5 31.6,57.8 34.2,57.8 36.8,57.8 29.2,57.8 30.3,56.5 32.9,56.5 35.5,56.5 39.3,57.8 38,56.5 39.3,55.2 41.8,55.2 41.8,57.8 40.5,56.5 44.2,55.2 43,56.5 45.4,56.5 46.7,55.2 44.3,57.8 46.8,57.8 40.5,53.9 43,53.9 45.4,59.3
  pour Top (no thermals): 26.3,66.2 26.3,57 27.3,56 37.6,56 40.8,52.8 48.1,52.8 48.1,66 47.1,67 27.1,67
  pour Route2 (no thermals): 26.3,66.2 26.3,57 27.3,56 37.6,56 40.8,52.8 48.1,52.8 48.1,66 47.1,67 27.1,67
BATTERY_OUT+  (via drill 0.35, 4 pad 8)
  Route15 0.508: v128,58 128,42 123,37 | 123,37 62,37 17,37 9,29 v9,22 | 123,37 136,24 151,24 v156,19 | I2.4 24.42,13 52,13 58,7 v71,7
  Route15 0.61: v62,34 62,37
  Bottom 0.508: v128,58 131,61 Z2.3 | v156,19 157.3,17.7 Z3.3 | Z4.3 71.6,7.6 v71,7
  Bottom 0.61: R28.2 9.74,21.26 v9,22 | Z7.3 66.5,32.5 65,34 v62,34
  other vias: 5,18.2 5,26 6.3,27.2 3.8,22.1 3.8,19.5 3.8,24.7 3.8,27.2 14,19.5 17.9,18.2 20.5,20.8 19.2,19.5 20.5,18.2 14,24.7 15.3,23.4 14,22.1 16.6,24.7 17.9,23.4 19.2,24.7 15.3,25.9 17.9,25.9 12.8,18.2 12.8,25.9 11.3,27.3 13.9,27.3 16.4,27.3 19,27.3 21.6,27.3 21.6,22 21.6,19.4 22.9,18.1 24.2,22 22.9,20.7 24.2,19.4 20.3,25.9 24.2,24.6 22.9,23.3 24.5,11.5 18,15.4 19.3,14.1 18,12.8 20.6,15.4 21.9,14.1 20.6,12.8 23.2,15.4 23.2,12.8 19.3,16.6 16.8,11.5 24.5,14.1 21.7,16.7 24.3,16.7
  pour Top (no thermals): 15.06,16.04 15.08,16.02 15.08,5.58 15.58,5.08 24.42,5.08 24.92,5.58 24.92,27.42 24.42,27.92 3.58,27.92 3.08,27.42 3.08,17.58 3.58,17.08 14.02,17.08 14.04,17.06
  pour Route2 (no thermals): 15.06,16.04 15.08,16.02 15.08,5.58 15.58,5.08 24.42,5.08 24.92,5.58 24.92,27.42 24.42,27.92 3.58,27.92 3.08,27.42 3.08,17.58 3.58,17.08 14.02,17.08 14.04,17.06
BATTERY_OUT_I_SENSE+  (via drill 0.35)
  other vias: 28,15 29.3,18.9 28,17.6 29.3,16.3 30.6,15 31.9,18.9 30.6,17.6 31.9,16.3 33.2,15 34.5,18.9 33.2,17.6 34.5,16.3 28,22.8 29.3,21.5 28,20.2 30.6,22.8 31.9,21.5 30.6,20.2 33.2,22.8 33.2,20.2 29.3,24 29.2,5.7 31.8,5.7 34.4,5.7 26.8,18.9 26.8,16.3 26.8,21.5 26.8,24 38.3,17.6 37,11.1 38.2,9.8 37,8.4 37,16.3 38.3,15 40.9,17.6 39.6,11.1 40.8,9.8 39.6,8.4 39.6,16.3 40.9,15 43.5,17.6 42.2,11.1 43.4,9.8 42.2,8.4 42.2,16.3 43.5,15 37,21.5 38.3,20.2 37,18.9 39.6,21.5 40.9,20.2 39.6,18.9 42.2,21.5 42.2,18.9 38.3,22.7 40.9,22.7 37,5.8 38.2,7.1 39.6,5.8 40.8,7.1 42.2,5.8 43.4,7.1 35.8,9.8 35.8,17.6 35.8,15 35.8,20.2 35.8,22.7 34.5,21.5 30.4,25.4 31.7,24.1 33,25.4 34.3,24.1 35.6,25.4 36.9,24.1 31.7,29.3 30.4,28 33,30.6 34.3,29.3 33,28 35.6,30.6 35.6,28 34.3,31.8 40.7,25.4 39.4,24.1 43.3,25.4 42,24.1 45.9,25.4 44.6,24.1 39.4,29.3 40.7,28 42,29.3 43.3,28 44.6,29.3 40.7,30.5 43.3,30.5 38.2,25.4 38.2,28 38.2,30.5 36.9,29.3 44.6,18.8 44.5,11 44.6,16.2 45.9,14.9 47.2,18.8 47.1,11 45.9,9.6 45.9,17.5 47.2,16.2 48.5,14.9 49.7,11 48.5,9.6 48.5,17.5 49.8,16.2 43.3,22.7 44.6,21.4 43.3,20.1 45.9,22.7 47.2,21.4 45.9,20.1 47.2,23.9 44.5,8.3 47.1,8.3 49.7,8.3 49.8,5.7 48.4,7 47.2,5.7 45.8,7 44.6,5.7 45.9,28 39.5,31.7 42.1,31.7 44.7,31.7 37,31.7
  pour Top (no thermals): 27,5.11 38.02,5.11 50.1,5.1 50.7,5.7 50.7,17.5 47.69,20.51 47.79,32.85 34.68,32.85 26.08,24.25 26.08,6.03
  pour Route2 (no thermals): 27,5.11 38.02,5.11 50.1,5.1 50.7,5.7 50.7,17.5 47.69,20.51 47.79,32.85 34.68,32.85 26.08,24.25 26.08,6.03
CAP  (via drill 0.45)
  Top 0.305: U6.9 64.04,47.33 64.23,47.14 C14.1
  other vias: 64.23,46.96
CHARGER+  (via drill 0.35)
  Top 0.254: 63.7,48.33 U6.11 63.8,48.33 C14.2 | D2.3 101.3,47 v101.6,47.3
  Top 0.813: 72.97,49.01 C16.1
  Bottom 0.813: R33.2 56.23,51.61 56.82,52.2 63.2,52.2 63.68,51.72 C15.1 63.68,49.31 C14.2
  other vias: 67.5,46 72.4,46 75,46 77.6,46 70,46 80.1,46 82.7,48.6 81.4,47.3 85.2,48.6 83.9,47.3 82.6,46 86.4,47.3 87.7,48.6 87.7,46 89,47.3 90.3,48.6 90.3,46 91.6,47.3 85.1,46 92.8,48.6 92.8,46 67.6,48.6 68.8,47.3 75.1,48.6 70.1,48.6 71.2,47.3 73.8,47.3 76.4,47.3 80.2,48.6 78.9,47.3 95.2,48.6 93.9,47.3 96.4,47.3 97.7,48.6 97.7,46 99,47.3 100.3,48.6 100.3,46 95.1,46 102.8,48.6 102.8,46 64.23,48.76
  pour Top (no thermals): 103.3,49.7 70.5,49.7 69.8,49 65.5,49 64.8,49.7 63.9,49.7 63.3,49.1 63.3,46.1 65.9,43.5 69.1,43.5 70.2,44.6 103.3,44.6
  pour Route2 (no thermals): 103.3,49.7 70.5,49.7 69.8,49 65.5,49 64.8,49.7 63.9,49.7 63.3,49.1 63.3,46.1 65.9,43.5 69.1,43.5 70.2,44.6 103.3,44.6
CURRENT_LIMIT_ENABLE
  Top 0.254: U6.8 62.47,46.86 63.14,46.86 63.26,46.74 63.26,43.94 64.7,42.5 70.5,42.5 79,34 94,34 95.62,32.38 J1.4
EXT_BUS+  (via drill 0.35, 4 pad 8)
  Bottom 0.61: R27.2 175.16,51 v179.6,51
  other vias: 167,51 170.5,47.1 171.8,48.4 173,47.1 174.2,48.4 175.5,47.1 171.9,51 173.1,49.7
  pour Route2 (no thermals): 163.08,54.92 163.08,47.13 163.58,46.63 183.42,46.63 183.92,47.13 183.92,54.92 183.42,55.42 163.58,55.42
  pour Top (no thermals): 163.08,54.92 163.08,47.13 163.58,46.63 183.42,46.63 183.92,47.13 183.92,54.92 183.42,55.42 163.58,55.42
EXT_BUS_FUSED+  (via drill 0.35, 4 pad 8)
  other vias: 167,61 152.5,60.9 152.5,58.3 155,60.9 157.6,60.9 160.2,60.9 156.2,59.6 154.9,58.3 156.1,57 158.8,59.6 157.5,58.3 158.7,57 161.4,59.6 160.1,58.3 161.3,57 153.7,59.6 153.7,57 162.6,58.3 163.7,56.9 171.4,59.5 171.4,56.9 170.3,66 167.7,66 165.1,66 163.8,64.7 171.5,64.7 161.3,62.1 161.4,64.7 160.2,66 162.6,63.4 162.6,66 162.5,60.8
  pour Route2 (no thermals): 151.78,66.42 151.78,57.08 152.28,56.58 171.42,56.58 171.92,57.08 171.92,66.42 171.42,66.92 152.28,66.92
  pour Top (no thermals): 151.78,66.42 151.78,57.08 152.28,56.58 171.42,56.58 171.92,57.08 171.92,66.42 171.42,66.92 152.28,66.92
EXT_BUS_I_SENSE+  (via drill 0.35)
  other vias: 132.8,63.5 132.7,60.9 132.8,66.1 131.5,64.8 135.4,63.5 134.1,62.2 135.3,60.9 135.4,66.1 134.1,64.8 138,63.5 136.7,62.2 137.9,60.9 138,66.1 136.7,64.8 130.3,63.5 130.3,66.1 131.4,59.6 131.4,57 132.7,58.3 134,59.6 134,57 135.3,58.3 136.6,59.6 136.6,57 137.9,58.3 130.2,58.3 140.4,60.9 143,60.9 145.6,60.9 141.6,59.6 140.3,58.3 141.5,57 144.2,59.6 142.9,58.3 144.1,57 146.8,59.6 145.5,58.3 146.7,57 139.1,59.6 139.1,57 140.5,66.1 140.4,63.5 139.2,64.8 139.2,62.2 148.1,60.9 149.3,59.6 148,58.3 149.2,57
  pour Route2 (no thermals): 129.78,67.02 129.78,56.48 149.42,56.48 149.92,56.98 149.92,66.52 149.42,67.02
  pour Top (no thermals): 129.78,56.48 149.42,56.48 149.92,56.98 149.92,66.52 149.42,67.02 129.78,67.02
FLOW_BUS+  (via drill 0.35)
  other vias: 74.9,14.1 73.6,10.2 74.8,8.8 73.6,12.8 74.8,11.5 73.6,18 74.9,16.7 73.6,15.4 140,21 139,19 133,19 128,21 130,21 132,21 131,19 132,17 131,15 130,17 129,15 128,17 129,19 136,21 135,19 137,19 138,21 134,17 134,21 133,15 128,13 130,13 132,13 131,11 132,9 130,9 129,11 133,11 128,9 77.5,14.1 76.2,10.2 77.4,8.8 76.2,12.8 77.4,11.5 76.2,18 77.5,16.7 76.2,15.4 80.1,14.1 78.8,10.2 80,8.8 78.8,12.8 80,11.5 78.8,18 80.1,16.7 78.8,15.4 82.7,14.1 81.4,10.2 82.6,8.8 81.4,12.8 82.6,11.5 81.4,18 82.7,16.7 81.4,15.4 77.5,21.9 76.2,20.6 77.5,19.3 80.1,21.9 78.8,20.6 80.1,19.3 82.7,21.9 81.4,20.6 82.7,19.3 76.2,23.1 78.8,23.1 81.4,23.1 106.5,54.7 107.8,58.6 106.5,52.1 107.7,50.8 106.5,49.4 106.5,57.3 107.8,53.4 107.8,56 109.1,54.7 110.4,58.6 109.1,52.1 110.3,50.8 109.1,49.4 109.1,57.3 110.4,53.4 110.4,56 111.7,54.7 113,58.6 111.7,52.1 112.9,50.8 111.7,49.4 111.7,57.3 113,53.4 113,56 106.5,62.5 107.8,61.2 106.5,59.9 109.1,62.5 110.4,61.2 109.1,59.9 111.7,62.5 111.7,59.9 107.8,63.7 110.4,63.7 106.5,46.8 107.7,45.4 107.7,48.1 109.1,46.8 110.3,45.4 110.3,48.1 111.7,46.8 112.9,45.4 112.9,48.1 105.3,50.8 105.3,53.4 105.3,58.6 105.3,56 105.3,61.2 105.3,63.7
  pour Top (no thermals): 67.4,8.2 83.62,8.2 83.62,22.82 83.12,23.32 73.53,23.32 73.53,20.13 72.03,18.63 67.4,18.62
  pour Top (no thermals): 127.47,7.97 140.76,7.97 140.37,21.63 127.47,21.63
  pour Route2 (rank 2, no thermals): 134.73,47.42 126.61,55.53 126.61,61.59 123.98,64.22 104.8,64.22 104.3,63.72 104.3,44.3 103.2,43.2 74.1,43.2 73.17,42.27 73.17,8.13 75.03,6.27 133.47,6.27 134.73,7.53
  pour Top (no thermals): 113.6,64.3 104.6,64.3 104.2,63.9 104.2,44.9 113.1,44.9 113.6,45.4
FREQ
  Top 0.254: U6.2 59.47,48.4 59.02,48.4 58,49.42 58,50 57.2,50.8 R32.2
G_PRECHARGE_4  (via drill 0.35)
  Top 0.254: 58.3,25 56.04,25 U19.1
  Top 0.61: v55.9,34.1 55.9,32.53 U20.1 56.06,32.6 60.1,32.6 60.9,31.8 60.9,26 59.9,25 58.3,25 | U19.1 60.14,25.03 R49.1
  Bottom 0.61: R17.2 54.36,33.46 55,34.1 v55.9,34.1 57.66,34.1 58.46,33.3 R16.1
G_SWITCH_2  (via drill 0.35)
  Top 0.61: 116,55.84 116,56.5
  Top 0.813: U8.1 121.83,56.5 116,56.5 | R11.1 116,55.84 v116,62.6 116,63.7 116.53,64.23 U3.1
  Bottom 0.813: R3.2 115.88,62.72 v116,62.6 | R2.1 121.43,64.77 U3.1
  other vias: 121.43,64.23
G_SWITCH_3  (via drill 0.35)
  Top 0.254: U25.1 149.24,19 153,19 154,18 154,12 152.71,10.71 U24.1
  Top 0.508: U24.1 151.29,10.71 v152,10 149.77,7.77 R12.1
  Bottom 0.508: v152,10 149.58,10 R5.1 150,9.28 150,8 149,7 146,7 145,8 145,9.6 R6.2
G_SWITCH_4  (via drill 0.35)
  Top 0.61: v59,18.4 59,16.06 U29.1 62.73,15.97 64.1,14.6 64.1,10 62.69,8.59 61.91,8.59 | U28.1 61.91,8.59 | 61.91,8.59 62,8.5 62,6.98 R48.1
  Bottom 0.61: R8.1 61.59,17.35 60.54,18.4 v59,18.4 57.86,18.4 56.71,17.25 R9.2
GATE
  Top 0.254: U6.12 62.44,52.44 R37.1
GATE_DRIVE_VCC_2
  Bottom 0.508: U22.2 117.36,67.65 124.35,67.65 125,67 125,64.36 U2.1 123.6,62.96 C2.1 126.14,63.03 Z2.2
GATE_DRIVE_VCC_3
  Bottom 0.508: U26.2 151.23,16.56 U23.1 152.72,16.39 C23.1 154.9,16.73 Z3.2
GATE_DRIVE_VCC_4  (via drill 0.35)
  Top 0.61: v65,18 66.89,16.11 v66.89,16
  Bottom 0.61: U30.2 62.47,7.21 62.47,7.92 62.3,8.1 61.9,8.1 60,10 60,13.21 61.18,14.38 U27.1 65,17.84 v65,18 | Z4.2 69.37,14.16 C26.1 67.07,15.82 v66.89,16
GATE_DRIVE_VCC_PRECHARGE_4
  Bottom 0.61: Z7.2 62.18,32.03 C22.1 60.12,31.92 U18.1 58.22,30.39 57,29.16 57,22.74 U21.2
GND  (via drill 0.35, 0.45, 2 pad 5, 4 pad 8)
  Top 0.254: U6.3 58.66,47.83 v58.5,47.99 | U6.13 v60.58,47.99 v60.58,48.9
  Top 0.508: v54.9,49 56.67,49 R32.1
  Top 0.61: C11.1 C10.2 25.36,41.97 I3.2 | C9.1 C8.2 25.72,33.77 I2.2 | C7.1 C6.2 150.87,39.2 I1.2 | U5.4 95.8,26.9 96.91,25.79 C29.1 v102.73,26.8 | U4.4 114.8,25.61 115.42,24.98 C28.1 121.5,25.05 v121.5,26.1
  Top 0.813: D1.2 D1.1 | C12.1 49.13,44.23 v49.1,44.2 | C13.1 54.5,42.1 v53.7,42.1 | R31.1 58.93,41.23 v58.9,41.2
  Top 1.27: C16.2 72.92,54 v72.9,54 | D1.1 75.86,57.2 v75.9,57.2 | D1.2 73.78,57.1 v73.8,57.1 | C18.2 47.08,48.82 v47.1,48.8 | R30.1 49.54,47.06 v49.5,47.1 | C17.2 v77.2,54
  Bottom 0.508: U18.3 61.65,27.84 v61.8,28 | U27.3 65.64,11.85 v65.7,11.9 | U23.3 154.16,13.85 v155,13 155,14.91 Z3.1 155.02,14.93 C23.2
  Bottom 0.61: R24.1 175.07,61 v179.6,61 | v9,51 10.38,52.38 R23.1 | v9,12 11.22,14.22 R25.1 | Z4.1 69.25,12.36 C26.2 66.8,12.09 v66.8,11.6 | C22.2 Z7.1 72.11,30.11 v73,31
  Bottom 0.813: C2.2 127.35,61.16 v127.4,61.11 Z2.1 | v126.72,60.27 123.45,60.27 U2.3
  Bottom 1.016: R29.1 57.56,44.14 v57.6,44.1 | C15.2 61.03,50.93 v61,50.9
  other vias: 179.29,22 115.15,10.1 72.9,52.6 77.2,52.6 60,41.2 50.7,47.1 47.1,50 61.38,48.9 61.38,48 60.58,47.2 61.38,47.2 60.58,46.3 61.38,46.3 158,27.4 159.2,26.1 157.9,24.8 162.9,27.4 165.5,27.4 168.1,27.4 160.5,27.4 161.6,26.1 162.9,24.8 164.2,26.1 165.5,24.8 166.8,26.1 166.8,23.5 168.1,24.8 160.4,24.8 170.6,27.4 169.3,26.1 169.3,23.5 170.6,24.8 173.2,30 171.9,28.7 175.7,30 174.4,28.7 173.1,24.8 171.8,23.5 173,22.2 173.1,27.4 171.8,26.1 171.7,20.9 176.9,28.7 178.2,30 178.2,27.4 179.5,28.7 180.8,30 180.8,27.4 182.1,28.7 174.2,20.9 175.6,27.4 175.5,24.8 174.3,26.1 183.3,30 183.3,27.4 158.1,30 159.3,28.7 163,30 165.6,30 168.2,30 160.6,30 161.7,28.7 164.3,28.7 166.9,28.7 170.7,30 169.4,28.7 170.6,22.1 173.8,63.3 175,62 173.9,65.9 175.1,64.6 178.8,65.9 181.4,65.9 176.4,65.9 182.7,64.6 5.1,6.7 5.1,9.3 6.4,8 7.7,6.7 10.3,6.7 11.6,8 5.1,14.5 6.4,15.7 3.9,10.6 3.9,8 3.9,13.2 3.9,15.7 12.9,9.3 12.9,6.7 11.4,15.8 5.8,45.2 5.8,47.8 7.1,46.5 8.4,45.2 11,45.2 12.3,46.5 13.7,50.3 9.7,46.5 4.6,49.1 4.6,46.5 4.5,51.7 13.7,52.5 13.6,47.8 13.6,45.2 12.1,54.3
  pour Top (no thermals): 157.43,30.02 157.43,24.58 157.93,24.08 165.72,24.08 170.02,19.78 174.22,19.78 176.4,17.6 183.4,17.6 183.9,18.09 183.92,19.78 183.92,29.92 183.32,30.52 157.93,30.52
  pour Route15: 188,3.2 188,69.8 arc90 184.8,73 3.2,73 arc90 0,69.8 0,3.2 arc90 3.2,0 184.8,0 arc90
  pour Top: 173.5,56.51 183.5,56.51 184,57.01 184,66.3 183.5,66.8 173.5,66.8 173,66.3 173,57.01
  pour Top: 3.7,6.21 13.7,6.21 14.2,6.71 14.2,13.9 12.1,16 3.2,16 3.2,6.71
  pour Top: 4.4,44.71 14.4,44.71 14.9,45.21 14.9,52.4 12.3,55 4.4,55 3.9,54.5 3.9,45.21
I_SENSE_1
  Top 0.254: TP1.P$1 98.1,16.69 J2.5
  Top 0.61: I3.3 28.55,41.35 C11.2
  Bottom 0.61: I3.3 27.6,39.4 30,37 74,37 92,19 97,19 98.16,17.84 J2.5
I_SENSE_2
  Top 0.254: TP3.P$1 103.24,10.26 J2.7
  Top 0.61: C7.2 153.79,41.29 I1.3
  Bottom 0.61: I1.3 152.78,41.78 151,40 143,40 125,22 106,22 103.24,19.24 J2.7
I_SENSE_3
  Top 0.254: TP5.P$1 108.3,16.73 J2.9
  Top 0.61: C9.2 22.43,32.08 I2.3
  Bottom 0.61: I2.3 29.11,36 73,36 85,24 85,16 87,14 107,14 108.32,15.32 J2.9
ITH
  Top 0.254: R36.2 58.41,46.33 U6.6
  Top 0.508: R36.2 56.3,42.16 C13.2
N$2
  Top 0.61: LED8.A 57.94,22.07 R49.2
N$3
  Top 0.305: R11.2 LED2.A
N$7
  Bottom 0.508: R3.1 114.86,61.45 U2.7
N$9  (via drill 0.35)
  Top 0.305: v116,65.47 116.46,65.93 C3.1
  Bottom 0.305: v116,65.47 116,64.67 116.53,64.14 U22.1
  Bottom 0.508: U22.1 118.07,63.14 U2.8
N$13  (via drill 0.35)
  other vias: 63.8,23.3 63.7,20.7 63.8,25.9 66.4,23.3 65.1,22 66.3,20.7 66.4,25.9 65.1,24.6 69,23.3 67.7,22 69,25.9 67.7,24.6 71.5,20.7 71.6,25.9 70.3,24.6
  pour Top (no thermals): 72.32,35.22 63.58,35.22 63.08,34.72 63.08,20.58 63.58,20.08 71.82,20.08 72.32,20.58
  pour Route2 (no thermals): 72.32,35.22 63.58,35.22 63.08,34.72 63.08,20.58 63.58,20.08 71.82,20.08 72.32,20.58
N$16
  Bottom 0.508: U23.7 144.08,15.12 143.65,15.54 141.54,15.54 141,15 141,11 142.23,9.77 R6.1
N$18  (via drill 0.35)
  Top 0.508: v145,18 145,18.07 v146.93,20
  Bottom 0.508: 145.74,16.35 C25.1 | 145.74,16.35 U23.8 | U26.1 v146.94,20 v146.93,20 | v145,18 145.74,17.26 145.74,16.35
N$19
  Bottom 0.61: R17.1 52.46,32.57 53.91,31.12 54.88,31.12 55,31 55,30 54.12,29.11 U18.7
N$20
  Bottom 0.61: R9.1 54.81,16.19 55.31,15.69 57.31,15.69 58,15 58,14 57.12,13.12 U27.7
N$21
  Bottom 0.61: U18.8 51.38,30.39 51,30 51,25.53 C24.1 52.97,23.56 U21.1
N$22
  Bottom 0.61: U27.8 54.78,14.38 54,13.6 54,9 54.93,8.07 C27.1 57.17,6.93 U30.1
N$23
  Top 0.508: C12.2 R36.1
N$24  (via drill 0.35)
  Top 2.54: R37.2 65.11,62.58 | 74.43,62.58 D1.3
  other vias: 54.9,62.9 56.1,61.6 54.8,60.3 59.8,62.9 62.4,62.9 65,62.9 57.4,62.9 58.5,61.6 59.8,60.3 61.1,61.6 62.4,60.3 63.7,61.6 65,60.3 57.3,60.3 67.5,62.9 66.2,61.6 67.5,60.3 70.1,65.5 68.8,64.2 71.3,64.2 70,60.3 70,62.9 68.7,61.6 72.4,60.3 71.2,61.6 55,65.5 56.2,64.2 59.9,65.5 62.5,65.5 65.1,65.5 57.5,65.5 58.6,64.2 61.2,64.2 63.8,64.2 67.6,65.5 66.3,64.2 73.6,61.6 74.9,60.3 76.1,61.6 72.5,62.9 75.1,65.5 73.8,64.2 76.3,64.2 75,62.9 72.6,65.5 56,59.1 58.5,59 61.1,59 63.7,59 66.2,59 68.7,59 71.2,59
  pour Top (no thermals): 77.2,59.9 77.2,66 76.2,67 54.6,67 53.6,66 53.6,59.5 54.6,58.5 71,58.5 72.4,59.9
  pour Route2 (no thermals): 77.2,59.9 77.2,66 76.2,67 54.6,67 53.6,66 53.6,59.5 54.6,58.5 71,58.5 72.4,59.9
N$26
  Top 0.508: LED3.A 147.46,7.39 R12.2
N$27
  Top 0.61: LED7.A 59.51,7.15 R48.2
PGOOD  (via drill 0.35)
  Top 0.254: U6.7 62.44,41.79 R31.2
  Top 0.61: R31.2 R35.1 64.31,40.69 65.03,39.97 67.05,39.97 67.08,40 v70,40
  Route2 0.61: v70,40 75,35 75,28 77,26 101.61,26 J2.10
PRECHARGE_4  (via drill 0.35)
  Route2 0.508: v77,30 83,36 97,36 100.7,32.3 J1.6
  Bottom 0.508: U18.2 76.11,29.11 v77,30
S_PRECHARGE_4  (via drill 0.35)
  Top 0.61: v56,29 53.4,26.4 53.4,22.1 LED8.C
  Bottom 0.508: U18.6 53.35,27.9 54.9,27.9 v56,29
  Bottom 0.61: R16.2 56,32.17 v56,29 56,25.81 C24.2
  pour Top: 51.08,30.82 51.08,26.58 51.58,26.08 59.42,26.08 59.92,26.58 59.92,30.82 59.42,31.32 51.58,31.32
S_SWITCH_2  (via drill 0.35)
  Top 0.305: C3.2 119.1,66 124.2,66 124.7,65.5 124.7,62.7 123.69,61.69 U8.3 | LED2.C 124.7,53.3 124.7,58.3 123.85,59.15 U3.3
  Bottom 0.508: 119.78,60.17 U2.6 v119.8,60.17 119.8,64.5 R2.2
  pour Top (no thermals): 117.58,62.22 117.58,58.58 118.08,58.08 124.92,58.08 125.42,58.58 125.42,62.22 124.92,62.72 118.08,62.72
S_SWITCH_3  (via drill 0.35)
  Top 0.508: LED3.C 143.37,9.36 v147.01,13
  Bottom 0.508: R5.2 147.01,10.37 v147.01,13 146.17,13.85 U23.6 144.16,13.85 143.45,14.55 C25.2
  pour Top (no thermals): 145.03,12.08 151.97,12.08 152.92,13.03 152.92,15.97 151.97,16.92 145.03,16.92 144.08,15.97 144.08,13.03
S_SWITCH_4  (via drill 0.35)
  Top 0.61: LED7.C 55.37,9.37 58,12 v59,12
  Bottom 0.508: U27.6 56.31,11.9 58.9,11.9 v59,12
  Bottom 0.61: R8.2 59,16.16 v59,12 59,9.24 C27.2
  pour Top (no thermals): 54.08,14.42 54.08,10.58 54.58,10.08 62.42,10.08 62.92,10.58 62.92,14.42 62.42,14.92 54.58,14.92
SENSE  (via drill 0.35)
  Top 0.254: U6.10 65.57,47.83 v65.6,47.8
  Bottom 0.254: v65.6,47.8 65.6,50.91 65.63,50.94 67.16,52.47 R37.3
  other vias: 67.55,52.47
  pour Top (no thermals): 69.1,53.9 66.1,53.9 65.6,53.4 65.6,50.2 65.8,50 69.4,50 69.6,50.2 69.6,53.4
SS  (via drill 0.35)
  Top 0.254: U6.4 56.47,47.33 56.3,47.5 v56.3,47.6
  Bottom 0.254: v56.3,47.6 56.23,47.53
  Bottom 0.61: R33.1 56.23,47.53 R29.2
SWITCH_2
  Bottom 0.508: U2.2 121.44,61.45 121,61 121,48 108.32,35.32 J1.9
SWITCH_3  (via drill 0.35)
  Route2 0.508: v131,24 129,24 123,30 105,30 103.24,31.76 J1.7
  Bottom 0.508: v131,24 140.91,24 149.8,15.12 U23.2
SWITCH_4  (via drill 0.35)
  Route2 0.508: v77,28 84,35 96,35 98.16,32.84 J1.5
  Bottom 0.508: U27.2 62.12,13.12 v77,28
V_SENSE_1  (via drill 0.35, 0.65)
  Top 0.254: J2.4 95.6,16.73 TP7.P$1
  Top 0.61: v93.3,23.7 93.3,19.7 95.62,17.38 J2.4 | U5.2 U5.1 v99.6,30
  Bottom 0.61: v93.3,23.7 v99.6,30
V_SENSE_1_PRE  (via drill 0.35)
  Top 0.254: TP2.P$1 15.28,54.28 R23.2
  Top 0.61: U5.3 97.06,29.93 v97,30
  Bottom 0.61: R26.1 R23.2 20.72,54.28 36,39 75,39 84,30 v97,30
  other vias: 15.23,54.28
V_SENSE_2
  Top 0.254: TP9.P$1 J2.6
  Top 0.61: U5.6 U5.7 98.33,19.11 J2.6
V_SENSE_2_PRE  (via drill 0.35)
  Top 0.254: TP4.P$1 161.8,44.9 159.3,47.4 v159.3,50.3
  Top 0.61: v94.7,21.1 95.73,21.1 U5.5
  Route15 0.61: v170.91,55 164,55 v159.3,50.3 153,44 145,44 132,31 131,31 v130,32
  Bottom 0.61: R24.2 R27.1 173.06,55 v170.91,55 | v130,32 121,23 96.39,23 94.7,21.32 v94.7,21.1
V_SENSE_3
  Top 0.254: TP11.P$1 105.78,10.32 J2.8
  Top 0.61: J2.8 109.5,20.47 U4.5
V_SENSE_3_PRE  (via drill 0.35)
  Top 0.254: TP6.P$1 v13,16
  Top 0.61: U4.6 U4.7 115.87,19 v111.95,19
  Route15 0.61: v13,16 24,27 84,27 92,19 v111.95,19
  Bottom 0.61: R28.1 R25.2 13.12,16.12 v13,16
VFB
  Top 0.254: R30.2 52.81,46.92 57.99,46.92 58.09,46.83 U6.5
  Top 0.61: R30.2 R34.1
VIN  (via drill 2 pad 5)
  Bottom 0.813: J2.15 123.56,10.1 v120.9,10.1
WORM_BUS+  (via drill 0.35, 4 pad 8)
  other vias: 179.29,12 159.4,14.8 158.1,13.5 159.4,12.2 161.9,14.8 164.5,14.8 167.1,14.8 163.1,13.5 161.8,12.2 165.7,13.5 164.4,12.2 168.3,13.5 167,12.2 160.6,13.5 169.6,14.8 170.8,13.5 169.5,12.2 173.4,16.1 172,12.2 172,14.8 173.3,13.5 174.6,14.8 174.5,12.2 159.5,17.4 162,17.4 164.6,17.4 167.2,17.4 163.2,16.1 165.8,16.1 168.4,16.1 160.7,16.1 158.1,8.4 159.3,7.1 158,5.8 163,8.4 165.6,8.4 168.2,8.4 160.6,8.4 161.7,7.1 163,5.8 164.3,7.1 165.6,5.8 166.9,7.1 168.2,5.8 160.5,5.8 170.7,8.4 169.4,7.1 170.7,5.8 173.3,11 172,9.7 174.5,9.7 173.2,5.8 173.2,8.4 171.9,7.1 175.7,8.4 175.6,5.8 174.4,7.1 158.2,11 159.4,9.7 163.1,11 165.7,11 168.3,11 160.7,11 161.8,9.7 164.4,9.7 167,9.7 170.8,11 169.5,9.7 158.3,18.6 163.2,18.6 165.8,18.6 168.4,18.6 160.8,18.6 158.4,21.2 159.6,19.9 163.3,21.2 165.9,21.2 160.9,21.2 162,19.9 164.6,19.9 167.2,19.9 176.8,7.1 178.1,5.8 180.6,5.8 179.3,7.1 183,5.8 181.8,7.1
  pour Top (no thermals): 183.92,5.58 183.92,16.42 183.42,16.92 170.98,16.92 170.96,16.94 166.47,21.42 157.48,21.42 157.48,5.58 157.98,5.08 183.42,5.08
  pour Route2 (no thermals): 183.92,5.58 183.92,16.42 183.42,16.92 170.98,16.92 170.96,16.94 166.47,21.42 157.48,21.42 157.48,5.58 157.98,5.08 183.42,5.08

### Text on the board
tNames: + Charge - | V1 PRE | + Fuse - | + Pallet - | V2 PRE | MIT BIG Idea 2022 / WORMS Project Flow Controller / adim@mit.edu, prajtm@mit.edu | + Batt - | USB | V3 PRE | V1 | I1 | V2 | I2 | V3 | I3 | GND | VIN | + Worm Bus -